# EAGLE schematic IGBS-Rocket-v2_rev1 (EAGLE 9.6.2)

## Sheet 1 of 11: MCU
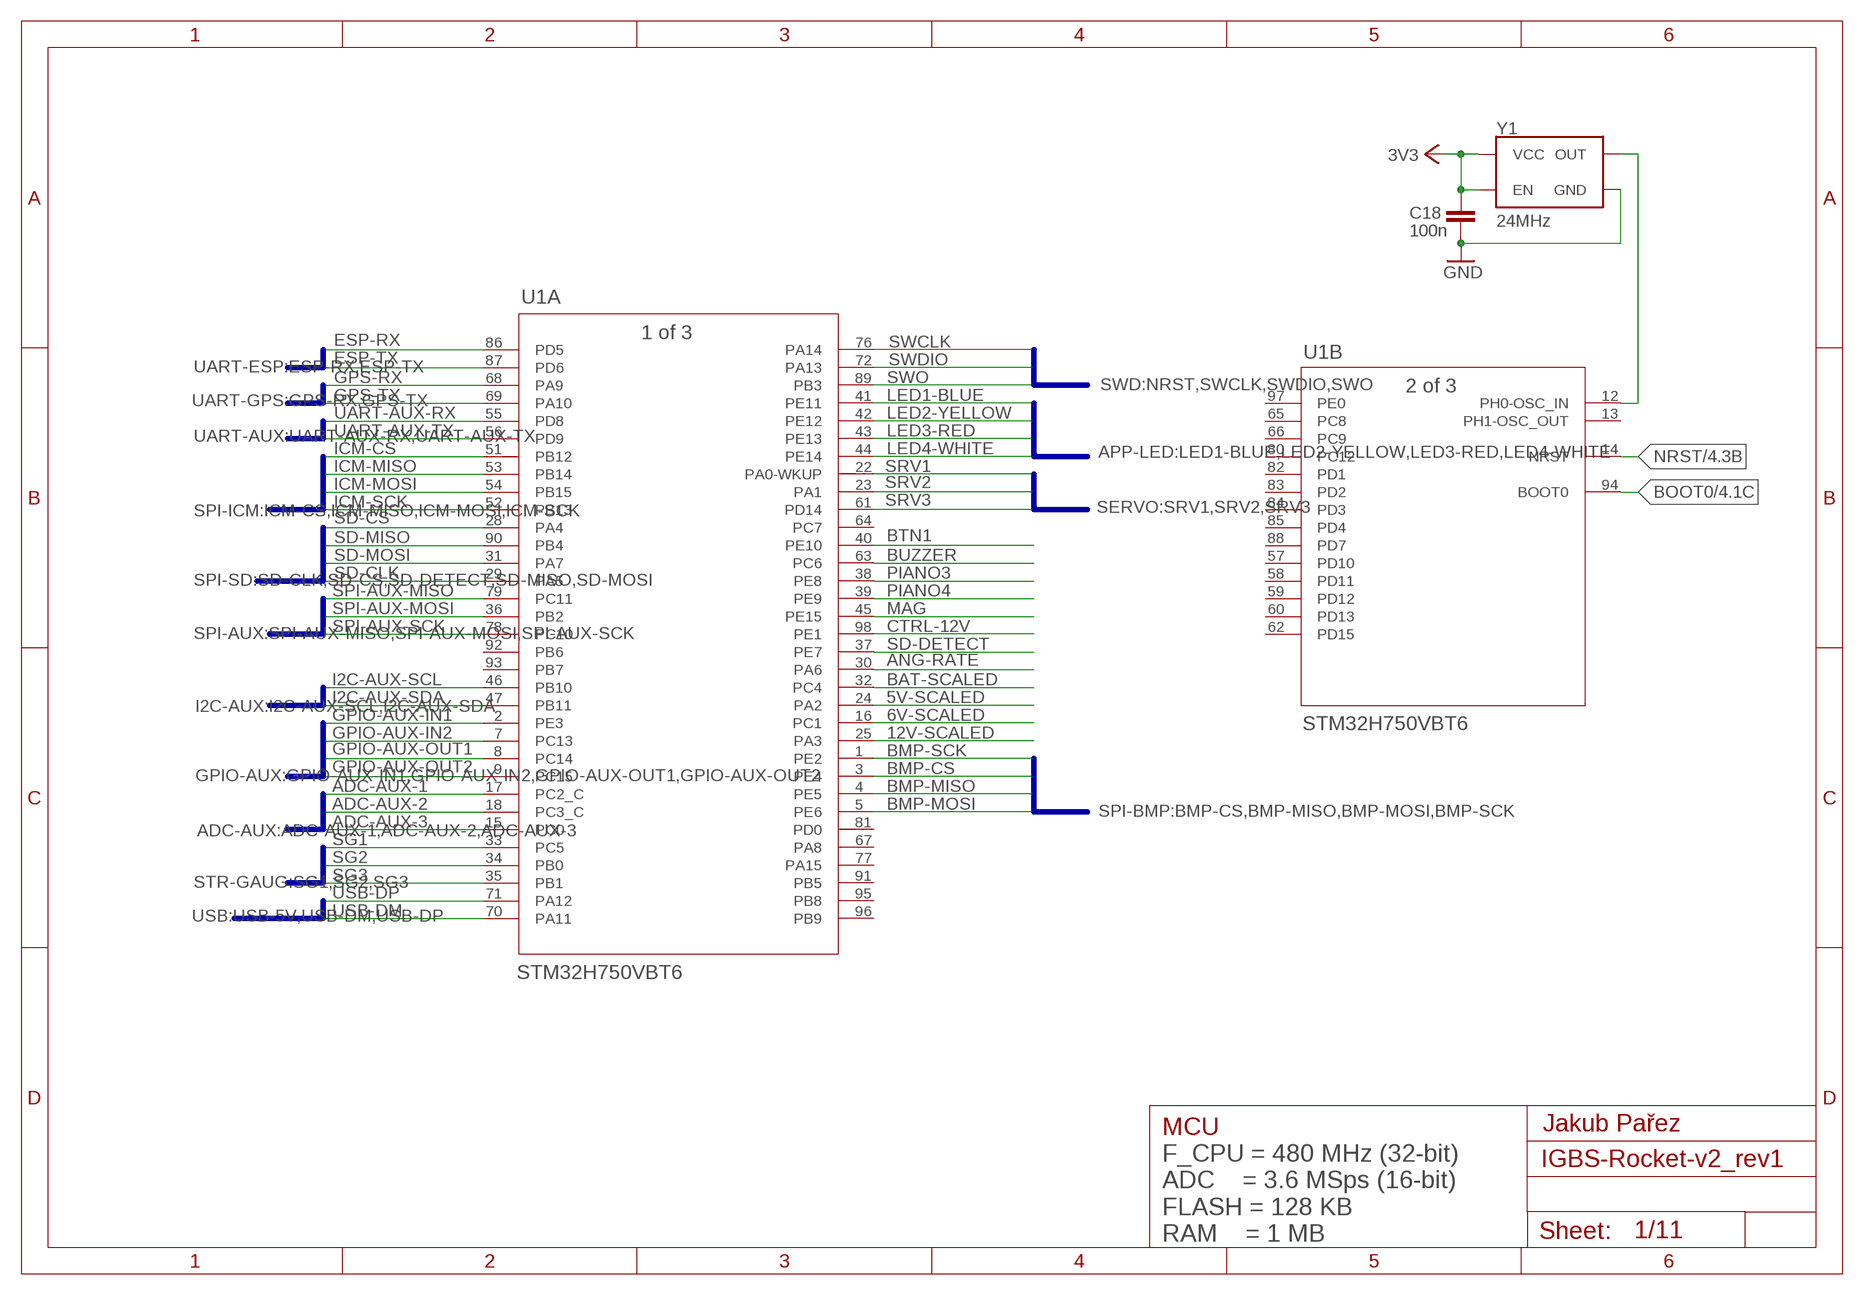
[diagram p0: schematic, sheet 1]

### Parts
C18  100n  C-EUC0603K  [C0603K]
U1  STM32H750VBT6  STM32H750VBT6LQFP100-14X14MM  [LQFP100-14X14MM]
Y1  24MHz  OSCILLATOR-16MHZSMD-7X5-4PAD  [OSCILLATOR-SMD-7X5-4PAD]

### Nets
3V3: C18.2 Y1.1(EN) Y1.4(VCC) ; also sheet 2,3,4,5,6,8,9,10
5V-SCALED: U1.24(A:PA2) ; also sheet 5
6V-SCALED: U1.16(A:PC1) ; also sheet 5
12V-SCALED: U1.25(A:PA3) ; also sheet 5
ADC-AUX-1: U1.17(A:PC2_C) ; also sheet 3
ADC-AUX-2: U1.18(A:PC3_C) ; also sheet 3
ADC-AUX-3: U1.15(A:PC0) ; also sheet 3
ANG-RATE: U1.30(A:PA6) ; also sheet 9
BAT-SCALED: U1.32(A:PC4) ; also sheet 5
BMP-CS: U1.3(A:PE4) ; also sheet 10
BMP-MISO: U1.4(A:PE5) ; also sheet 10
BMP-MOSI: U1.5(A:PE6) ; also sheet 10
BMP-SCK: U1.1(A:PE2) ; also sheet 10
BOOT0: U1.94(B:BOOT0) ; also sheet 4
BTN1: U1.40(A:PE10) ; also sheet 4
BUZZER: U1.63(A:PC6) ; also sheet 4
CTRL-12V: U1.98(A:PE1) ; also sheet 5
ESP-RX: U1.86(A:PD5) ; also sheet 8
ESP-TX: U1.87(A:PD6) ; also sheet 8
GND: C18.1 Y1.2(GND) ; also sheet 2,3,4,5,6,7,8,10
GPIO-AUX-IN1: U1.2(A:PE3) ; also sheet 3
GPIO-AUX-IN2: U1.7(A:PC13) ; also sheet 3
GPIO-AUX-OUT1: U1.8(A:PC14) ; also sheet 3
GPIO-AUX-OUT2: U1.9(A:PC15) ; also sheet 3
GPS-RX: U1.68(A:PA9) ; also sheet 10
GPS-TX: U1.69(A:PA10) ; also sheet 10
I2C-AUX-SCL: U1.46(A:PB10) ; also sheet 3
I2C-AUX-SDA: U1.47(A:PB11) ; also sheet 3
ICM-CS: U1.51(A:PB12) ; also sheet 10
ICM-MISO: U1.53(A:PB14) ; also sheet 10
ICM-MOSI: U1.54(A:PB15) ; also sheet 10
ICM-SCK: U1.52(A:PB13) ; also sheet 10
LED1-BLUE: U1.41(A:PE11) ; also sheet 4
LED2-YELLOW: U1.42(A:PE12) ; also sheet 4
LED3-RED: U1.43(A:PE13) ; also sheet 4
LED4-WHITE: U1.44(A:PE14) ; also sheet 4
MAG: U1.45(A:PE15) ; also sheet 10
N$7: U1.12(B:PH0-OSC_IN) Y1.3(OUT)
NRST: U1.14(B:NRST) ; also sheet 3,4
PIANO3: U1.38(A:PE8) ; also sheet 4
PIANO4: U1.39(A:PE9) ; also sheet 4
SD-CLK: U1.29(A:PA5) ; also sheet 7
SD-CS: U1.28(A:PA4) ; also sheet 7
SD-DETECT: U1.37(A:PE7) ; also sheet 7
SD-MISO: U1.90(A:PB4) ; also sheet 7
SD-MOSI: U1.31(A:PA7) ; also sheet 7
SG1: U1.33(A:PC5) ; also sheet 11
SG2: U1.34(A:PB0) ; also sheet 11
SG3: U1.35(A:PB1) ; also sheet 11
SPI-AUX-MISO: U1.79(A:PC11) ; also sheet 3
SPI-AUX-MOSI: U1.36(A:PB2) ; also sheet 3
SPI-AUX-SCK: U1.78(A:PC10) ; also sheet 3
SRV1: U1.22(A:PA0-WKUP) ; also sheet 5
SRV2: U1.23(A:PA1) ; also sheet 5
SRV3: U1.61(A:PD14) ; also sheet 5
SWCLK: U1.76(A:PA14) ; also sheet 3
SWDIO: U1.72(A:PA13) ; also sheet 3
SWO: U1.89(A:PB3) ; also sheet 3
UART-AUX-RX: U1.55(A:PD8) ; also sheet 3
UART-AUX-TX: U1.56(A:PD9) ; also sheet 3
USB-DM: U1.70(A:PA11) ; also sheet 3
USB-DP: U1.71(A:PA12) ; also sheet 3
Unconnected: U1.13(B:PH1-OSC_OUT) U1.57(B:PD10) U1.58(B:PD11) U1.59(B:PD12) U1.60(B:PD13) U1.62(B:PD15) U1.64(A:PC7) U1.65(B:PC8) U1.66(B:PC9) U1.67(A:PA8) U1.77(A:PA15) U1.80(B:PC12) U1.81(A:PD0) U1.82(B:PD1) U1.83(B:PD2) U1.84(B:PD3) U1.85(B:PD4) U1.88(B:PD7) U1.91(A:PB5) U1.92(A:PB6) U1.93(A:PB7) U1.95(A:PB8) U1.96(A:PB9) U1.97(B:PE0)

### Buses
UART-ESP:ESP-RX,ESP-TX
UART-GPS:GPS-RX,GPS-TX
UART-AUX:UART-AUX-RX,UART-AUX-TX
SPI-ICM:ICM-CS,ICM-MISO,ICM-MOSI,ICM-SCK
SPI-SD:SD-CLK,SD-CS,SD-DETECT,SD-MISO,SD-MOSI
SPI-AUX:SPI-AUX-MISO,SPI-AUX-MOSI,SPI-AUX-SCK
I2C-AUX:I2C-AUX-SCL,I2C-AUX-SDA
GPIO-AUX:GPIO-AUX-IN1,GPIO-AUX-IN2,GPIO-AUX-OUT1,GPIO-AUX-OUT2
ADC-AUX:ADC-AUX-1,ADC-AUX-2,ADC-AUX-3
STR-GAUG:SG1,SG2,SG3
USB:USB-5V,USB-DM,USB-DP
SWD:NRST,SWCLK,SWDIO,SWO
APP-LED:LED1-BLUE,LED2-YELLOW,LED3-RED,LED4-WHITE
SERVO:SRV1,SRV2,SRV3
SPI-BMP:BMP-CS,BMP-MISO,BMP-MOSI,BMP-SCK

### Notes on the sheet
- MCU | Jakub Pařez
- F_CPU = 480 MHz (32-bit)
  ADC    = 3.6 MSps (16-bit)
  FLASH = 128 KB
  RAM    = 1 MB

## Sheet 2 of 11: MCU PSU
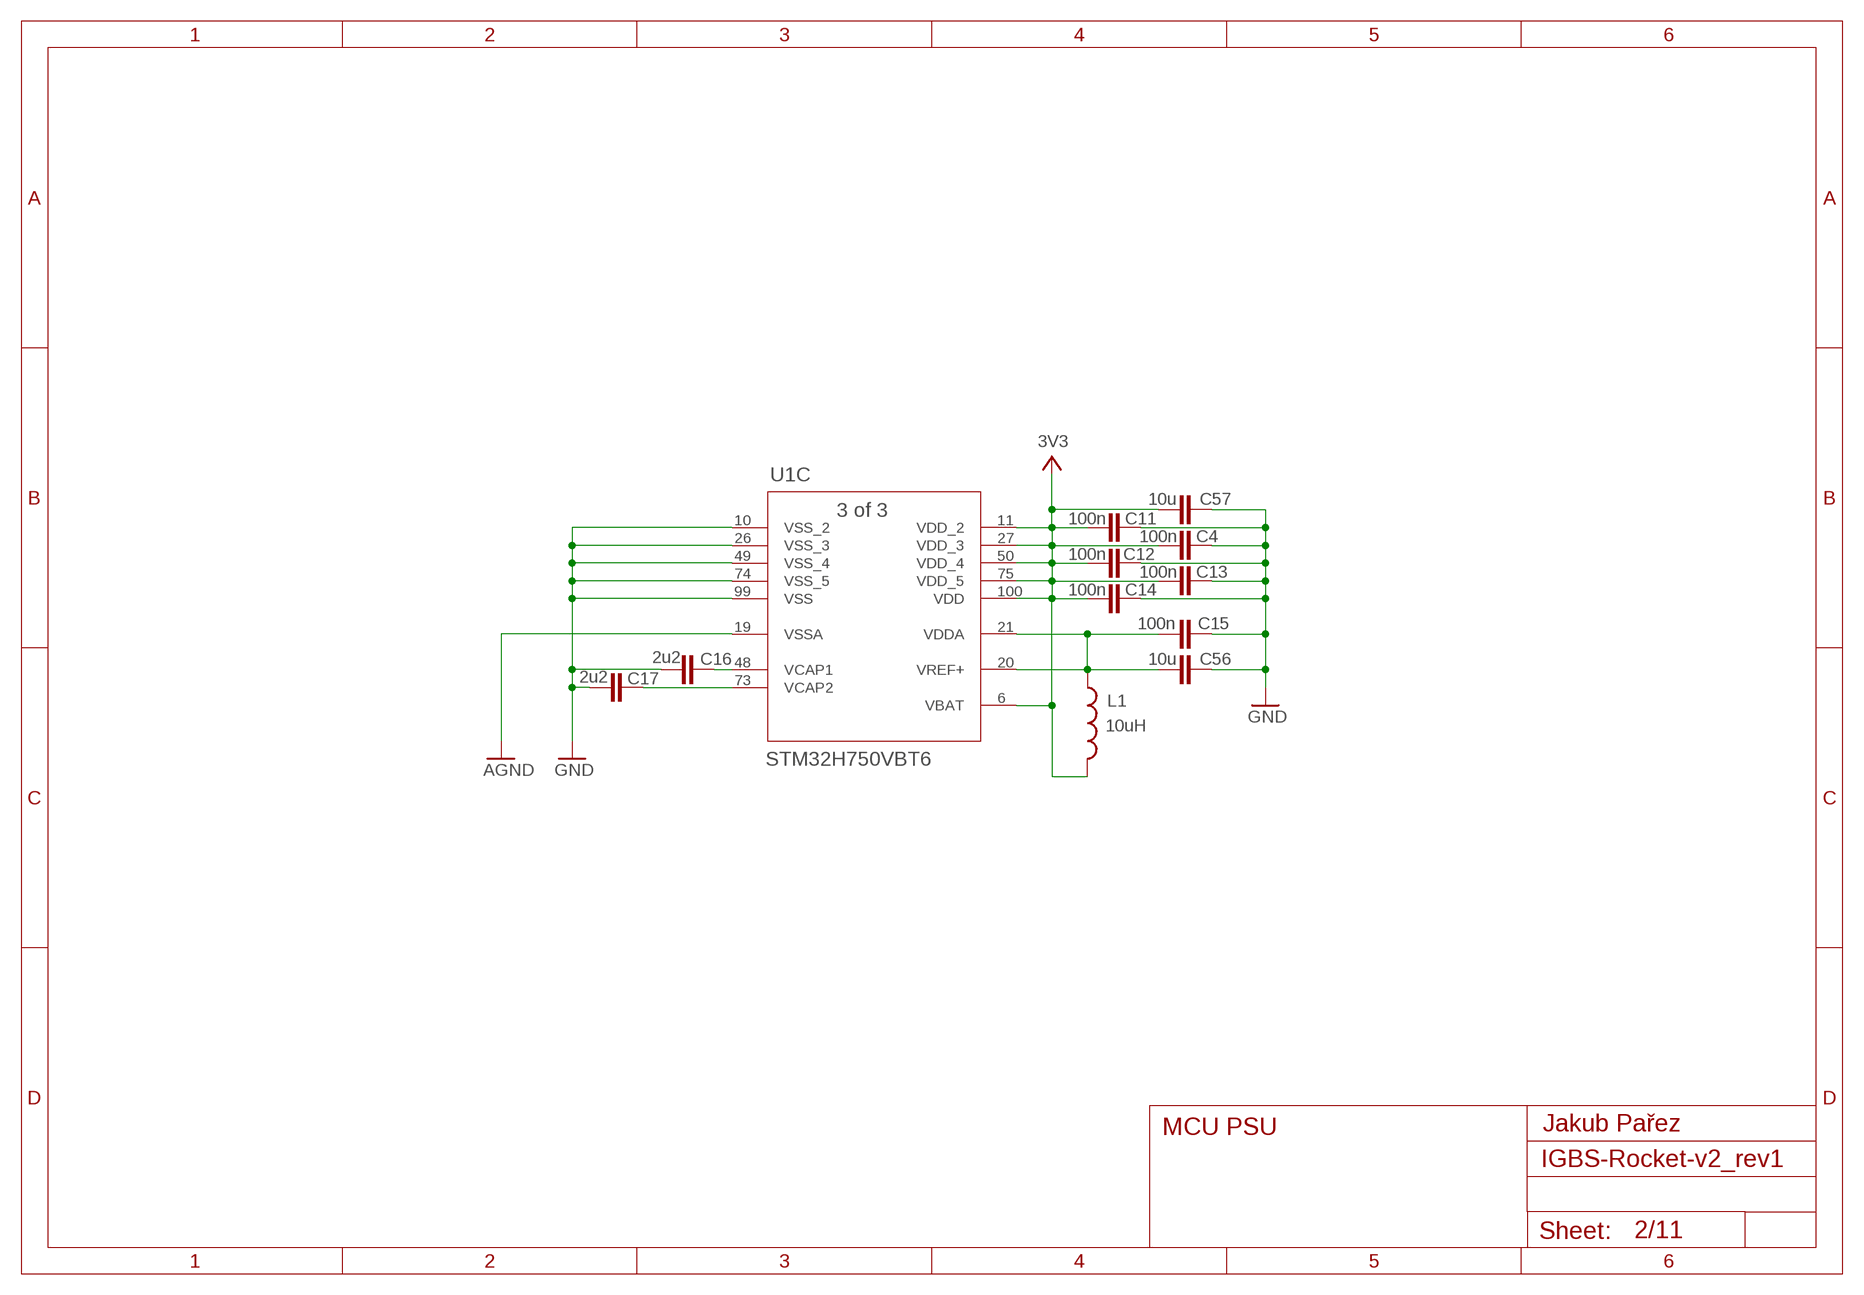
[diagram p1: schematic, sheet 2]

### Parts
C4  100n  C-EUC0603K  [C0603K]
C11  100n  C-EUC0603K  [C0603K]
C12  100n  C-EUC0603K  [C0603K]
C13  100n  C-EUC0603K  [C0603K]
C14  100n  C-EUC0603K  [C0603K]
C15  100n  C-EUC0603K  [C0603K]
C16  2u2  C-EUC0805K  [C0805K]
C17  2u2  C-EUC0805K  [C0805K]
C56  10u  10UF10V10%(0805)  [0805-CAP]
C57  10u  10UF10V10%(0805)  [0805-CAP]
L1  10uH  INDUCTOR0805  [0805]

### Nets
3V3: C4.2 C11.2 C12.2 C13.2 C14.2 C57.1 L1.2 U1.6(C:VBAT) U1.11(C:VDD_2) U1.27(C:VDD_3) U1.50(C:VDD_4) U1.75(C:VDD_5) U1.100(C:VDD) ; also sheet 1,3,4,5,6,8,9,10
AGND: U1.19(C:VSSA) ; also sheet 5,6,9,11
GND: C4.1 C11.1 C12.1 C13.1 C14.1 C15.1 C16.2 C17.1 C56.2 C57.2 U1.10(C:VSS_2) U1.26(C:VSS_3) U1.49(C:VSS_4) U1.74(C:VSS_5) U1.99(C:VSS) ; also sheet 1,3,4,5,6,7,8,10
N$4: C16.1 U1.48(C:VCAP1)
N$5: C17.2 U1.73(C:VCAP2)
VDDA: C15.2 C56.1 L1.1 U1.20(C:VREF+) U1.21(C:VDDA)

### Notes on the sheet
- MCU PSU | Jakub Pařez

## Sheet 3 of 11: Connectors
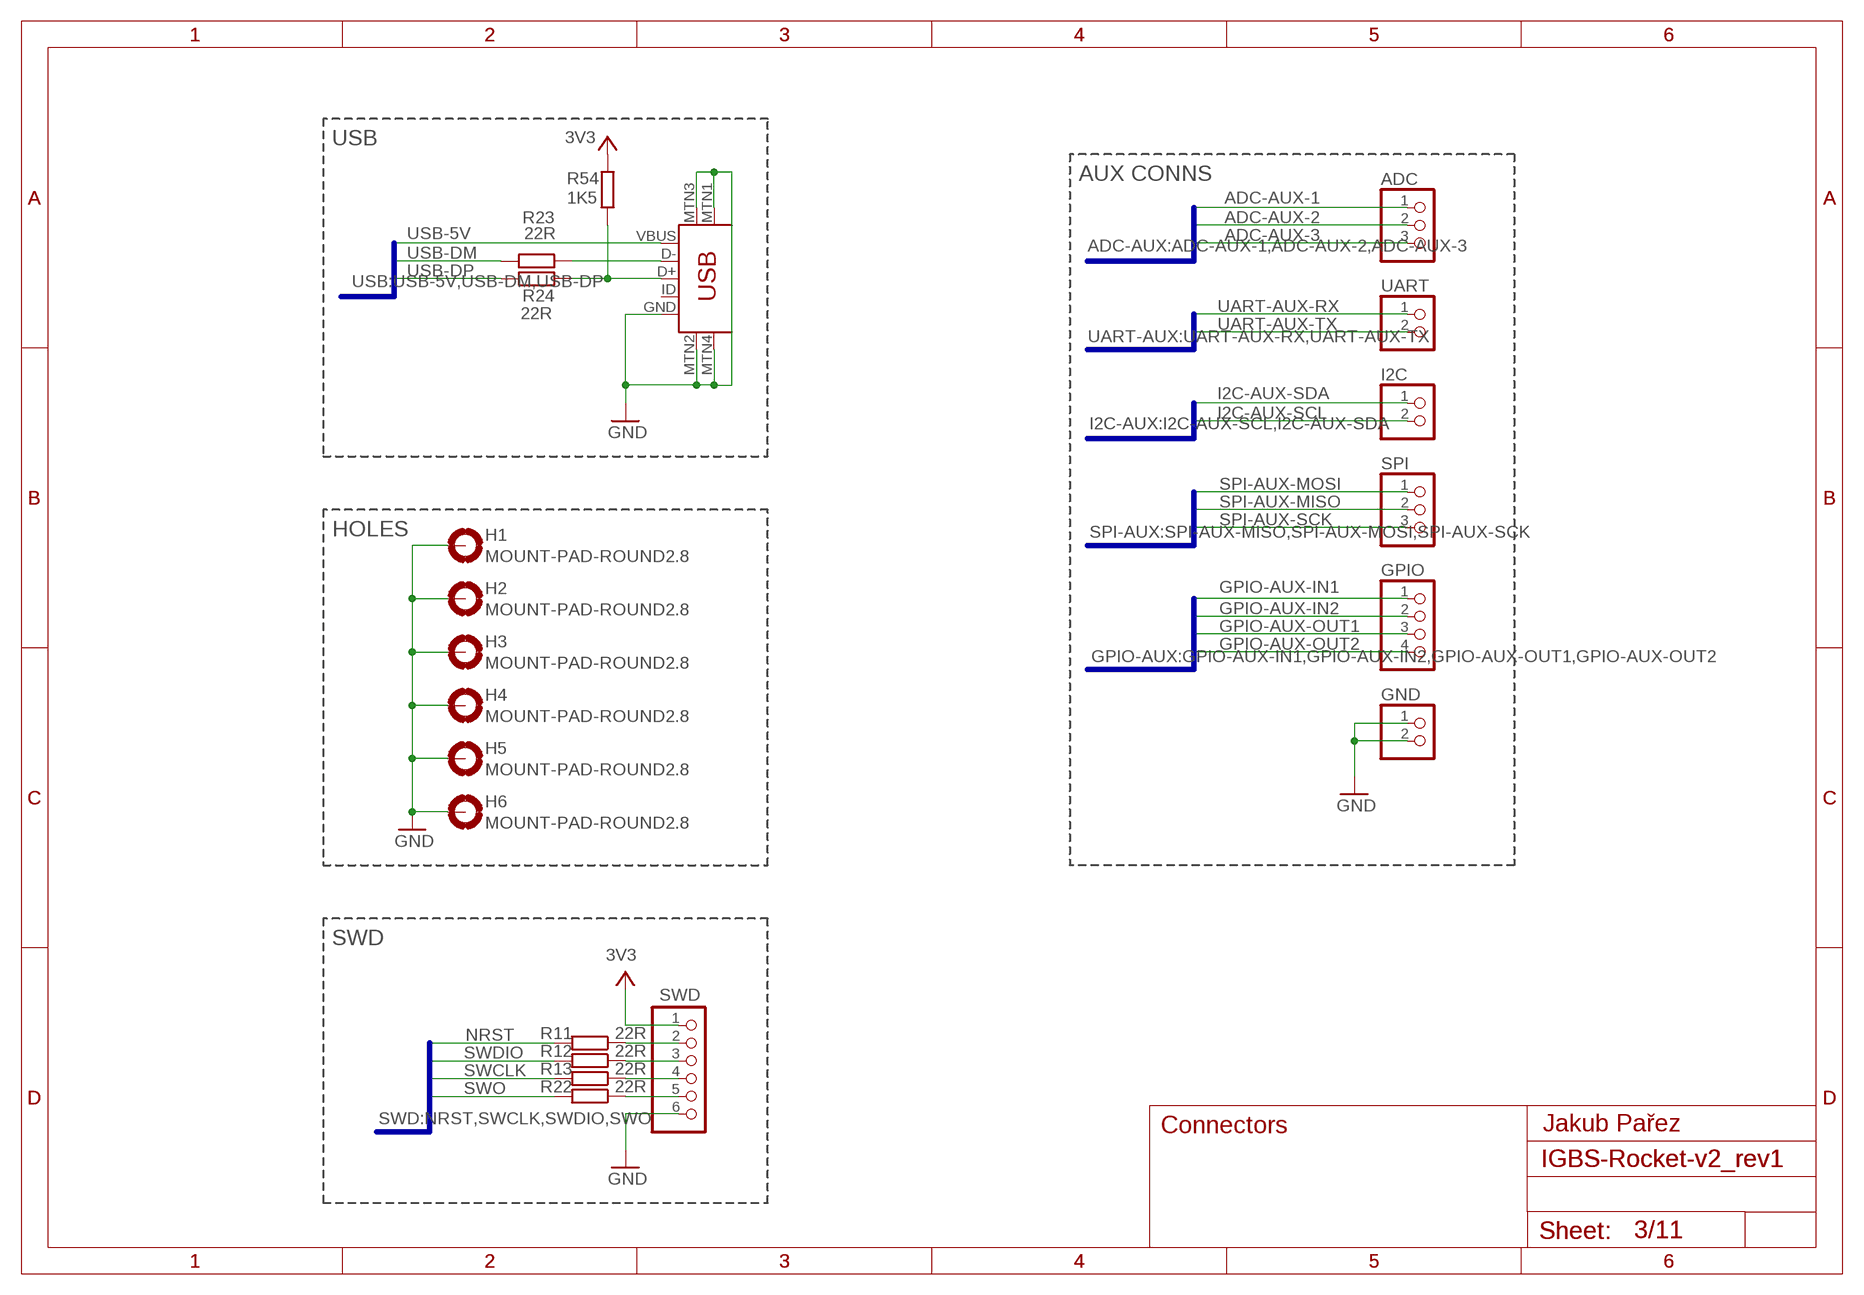
[diagram p2: schematic, sheet 3]

### Parts
ADC  PINHD-1X3  [1X03]
GND  PINHD-1X2  [1X02]
GPIO  PINHD-1X4  [1X04]
H1  MOUNT-PAD-ROUND2.8  [2,8-PAD]
H2  MOUNT-PAD-ROUND2.8  [2,8-PAD]
H3  MOUNT-PAD-ROUND2.8  [2,8-PAD]
H4  MOUNT-PAD-ROUND2.8  [2,8-PAD]
H5  MOUNT-PAD-ROUND2.8  [2,8-PAD]
H6  MOUNT-PAD-ROUND2.8  [2,8-PAD]
I2C  PINHD-1X2  [1X02]
R11  22R  R-EU_R0603  [R0603]
R12  22R  R-EU_R0603  [R0603]
R13  22R  R-EU_R0603  [R0603]
R22  22R  R-EU_R0603  [R0603]
R23  22R  R-EU_R0603  [R0603]
R24  22R  R-EU_R0603  [R0603]
R54  1K5  R-EU_R0603  [R0603]
SPI  PINHD-1X3  [1X03]
SWD  PINHD-1X6  [1X06]
UART  PINHD-1X2  [1X02]
USB  USB-MINIB-5PIN  [USB-MINIB]

### Nets
3V3: R54.2 SWD.1 ; also sheet 1,2,4,5,6,8,9,10
ADC-AUX-1: ADC.1 ; also sheet 1
ADC-AUX-2: ADC.2 ; also sheet 1
ADC-AUX-3: ADC.3 ; also sheet 1
GND: GND.1 GND.2 H1.B2,8(MOUNT) H2.B2,8(MOUNT) H3.B2,8(MOUNT) H4.B2,8(MOUNT) H5.B2,8(MOUNT) H6.B2,8(MOUNT) SWD.6 USB.GND USB.MTN1(MTN2) USB.MTN2(MTN3) USB.MTN3(MTN1) USB.MTN4 ; also sheet 1,2,4,5,6,7,8,10
GPIO-AUX-IN1: GPIO.1 ; also sheet 1
GPIO-AUX-IN2: GPIO.2 ; also sheet 1
GPIO-AUX-OUT1: GPIO.3 ; also sheet 1
GPIO-AUX-OUT2: GPIO.4 ; also sheet 1
I2C-AUX-SCL: I2C.2 ; also sheet 1
I2C-AUX-SDA: I2C.1 ; also sheet 1
N$6: R11.1 SWD.2
N$8: R12.1 SWD.3
N$14: R13.1 SWD.4
N$17: R22.1 SWD.5
N$19: R23.1 USB.D-
N$52: R24.1 R54.1 USB.D+
NRST: R11.2 ; also sheet 1,4
SPI-AUX-MISO: SPI.2 ; also sheet 1
SPI-AUX-MOSI: SPI.1 ; also sheet 1
SPI-AUX-SCK: SPI.3 ; also sheet 1
SWCLK: R13.2 ; also sheet 1
SWDIO: R12.2 ; also sheet 1
SWO: R22.2 ; also sheet 1
UART-AUX-RX: UART.1 ; also sheet 1
UART-AUX-TX: UART.2 ; also sheet 1
USB-5V: USB.VBUS
USB-DM: R23.2 ; also sheet 1
USB-DP: R24.2 ; also sheet 1
Unconnected: USB.ID

### Buses
SWD:NRST,SWCLK,SWDIO,SWO
USB:USB-5V,USB-DM,USB-DP
ADC-AUX:ADC-AUX-1,ADC-AUX-2,ADC-AUX-3
UART-AUX:UART-AUX-RX,UART-AUX-TX
I2C-AUX:I2C-AUX-SCL,I2C-AUX-SDA
SPI-AUX:SPI-AUX-MISO,SPI-AUX-MOSI,SPI-AUX-SCK
GPIO-AUX:GPIO-AUX-IN1,GPIO-AUX-IN2,GPIO-AUX-OUT1,GPIO-AUX-OUT2

### Notes on the sheet
- USB
- AUX CONNS
- HOLES
- SWD
- Connectors | Jakub Pařez

## Sheet 4 of 11: User Interaction
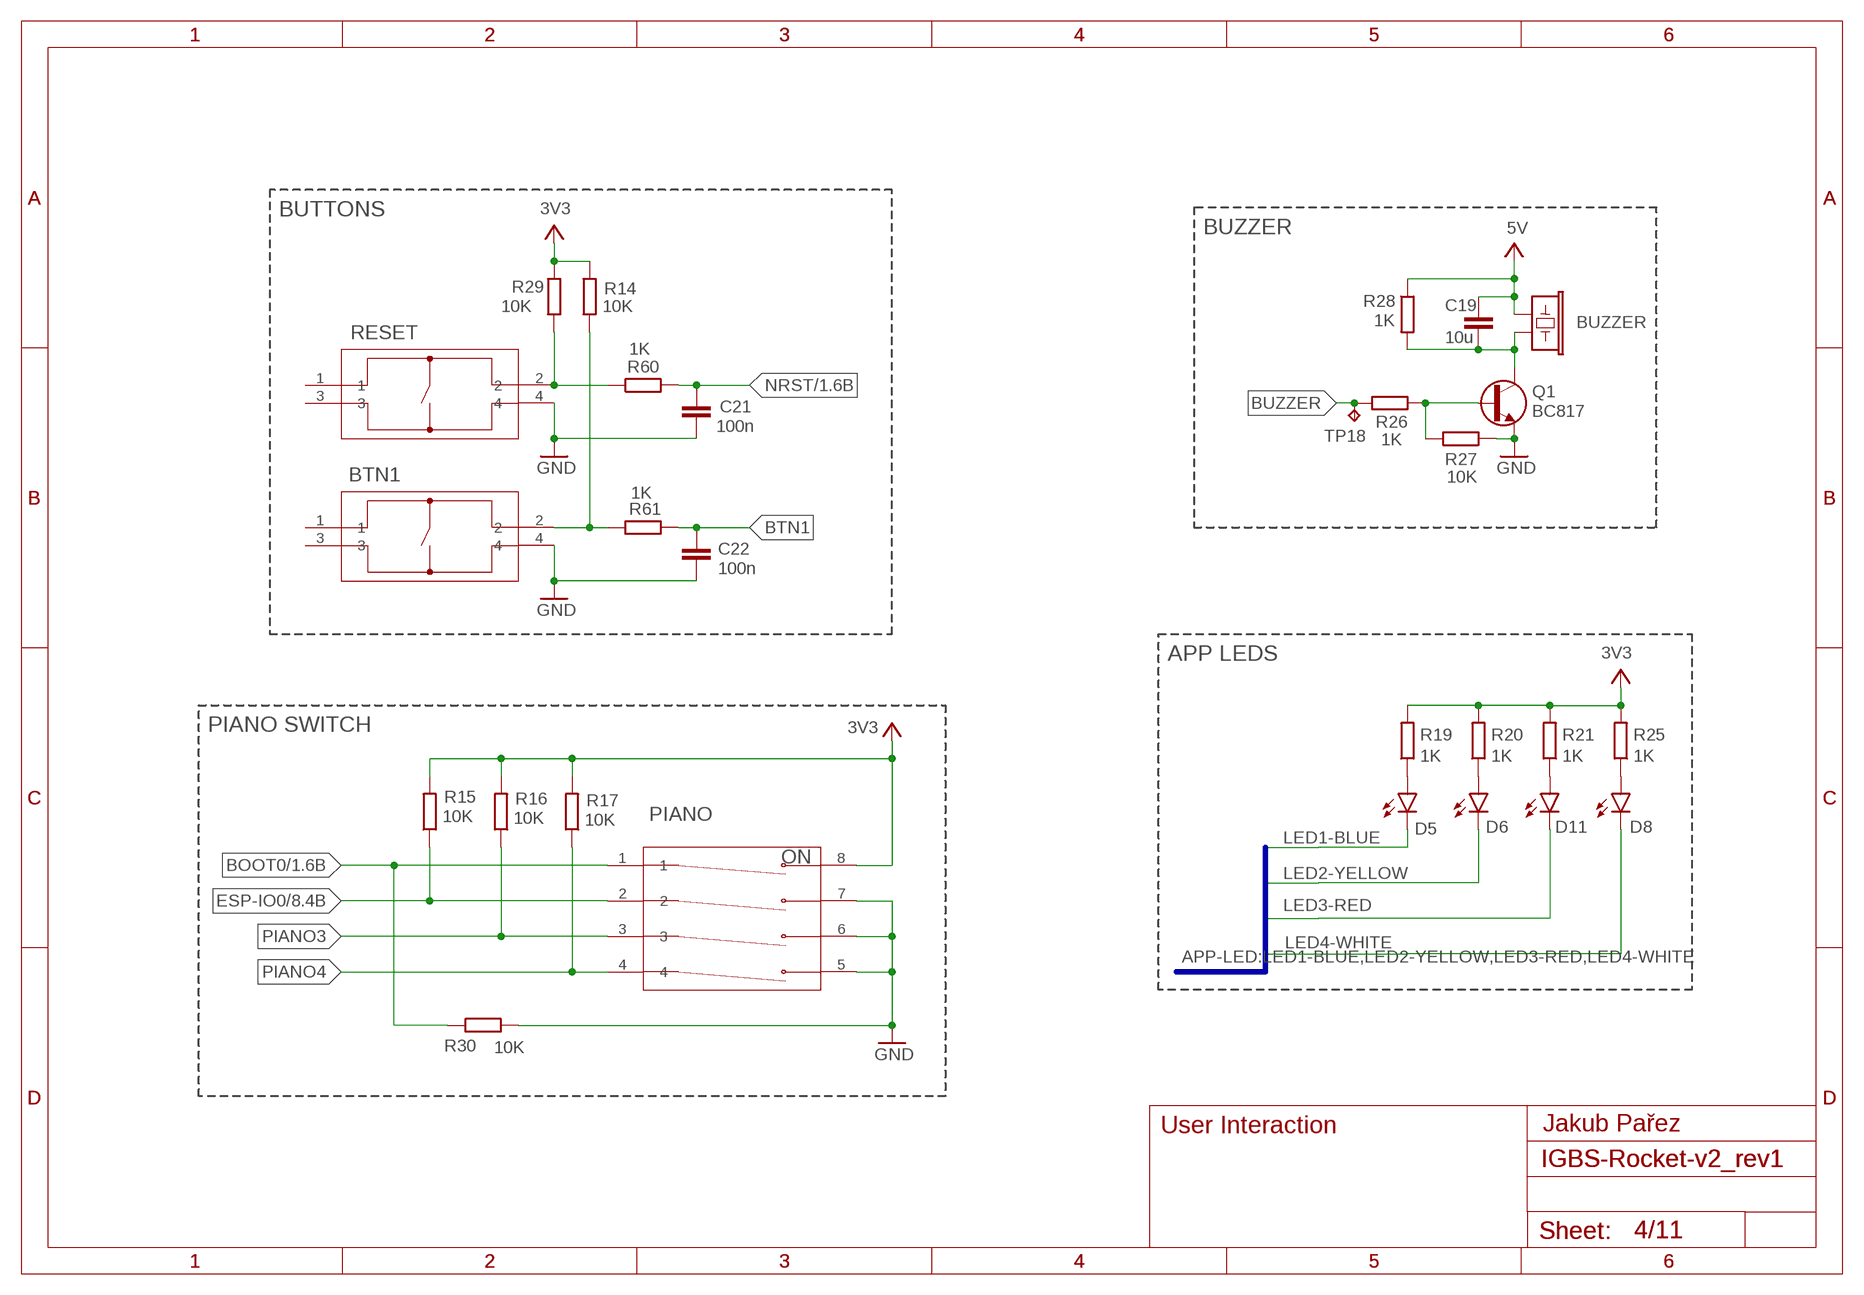
[diagram p3: schematic, sheet 4]

### Parts
BTN1  B3FS-1000SW_B3FS-1000_OMR  [SW_B3FS-1000_OMR]
BUZZER  BUZZERPTH  [BUZZER-12MM]
C19  10u  10UF10V10%(0805)  [0805-CAP]
C21  100n  C-EUC0603K  [C0603K]
C22  100n  C-EUC0603K  [C0603K]
D5  GREEN  LED-GREEN1206  [LED-1206]
D6  GREEN  LED-GREEN1206  [LED-1206]
D8  GREEN  LED-GREEN1206  [LED-1206]
D11  GREEN  LED-GREEN1206  [LED-1206]
PIANO  A6FR-4101SW_A6FR-4101_OMR  [SW_A6FR-4101_OMR]
Q1  BC817  BC817-16LT1SMD  [SOT23-BEC]
R14  10K  R-EU_R0603  [R0603]
R15  10K  R-EU_R0603  [R0603]
R16  10K  R-EU_R0603  [R0603]
R17  10K  R-EU_R0603  [R0603]
R19  1K  R-EU_R0603  [R0603]
R20  1K  R-EU_R0603  [R0603]
R21  1K  R-EU_R0603  [R0603]
R25  1K  R-EU_R0603  [R0603]
R26  1K  R-EU_R0603  [R0603]
R27  10K  R-EU_R0603  [R0603]
R28  1K  R-EU_R0603  [R0603]
R29  10K  R-EU_R0603  [R0603]
R30  10K  R-EU_R0603  [R0603]
R60  1K  R-EU_R0603  [R0603]
R61  1K  R-EU_R0603  [R0603]
RESET  B3FS-1000SW_B3FS-1000_OMR  [SW_B3FS-1000_OMR]
TP18  TPB1,27  [B1,27]

### Nets
3V3: PIANO.8 R14.1 R15.2 R16.2 R17.2 R19.2 R20.2 R21.2 R25.2 R29.1 ; also sheet 1,2,3,5,6,8,9,10
5V: BUZZER.+ C19.1 R28.1 ; also sheet 5,6,9,10,11
5V-BUZZER: BUZZER.- C19.2 Q1.C R28.2
BOOT0: PIANO.1 R30.1 ; also sheet 1
BTN1: C22.1 R61.2 ; also sheet 1
BTN12: BTN1.2 R14.2 R61.1
BUZZER: R26.2 TP18.TP ; also sheet 1
ESP-IO0: PIANO.2 R15.1 ; also sheet 8
GND: BTN1.4 C21.2 C22.2 PIANO.5 PIANO.6 PIANO.7 Q1.E R27.1 R30.2 RESET.4 ; also sheet 1,2,3,5,6,7,8,10
LED1-BLUE: D5.C ; also sheet 1
LED2-YELLOW: D6.C ; also sheet 1
LED3-RED: D11.C ; also sheet 1
LED4-WHITE: D8.C ; also sheet 1
N$1: D8.A R25.1
N$21: D5.A R19.1
N$22: D6.A R20.1
N$23: D11.A R21.1
N$28: Q1.B R26.1 R27.2
NRST: C21.1 R60.2 ; also sheet 1,3
NRST2: R29.2 R60.1 RESET.2
PIANO3: PIANO.3 R16.1 ; also sheet 1
PIANO4: PIANO.4 R17.1 ; also sheet 1
Unconnected: BTN1.1 BTN1.3 RESET.1 RESET.3

### Buses
APP-LED:LED1-BLUE,LED2-YELLOW,LED3-RED,LED4-WHITE

### Notes on the sheet
- BUTTONS
- BUZZER
- APP LEDS
- PIANO SWITCH
- User Interaction | Jakub Pařez

## Sheet 5 of 11: PSU
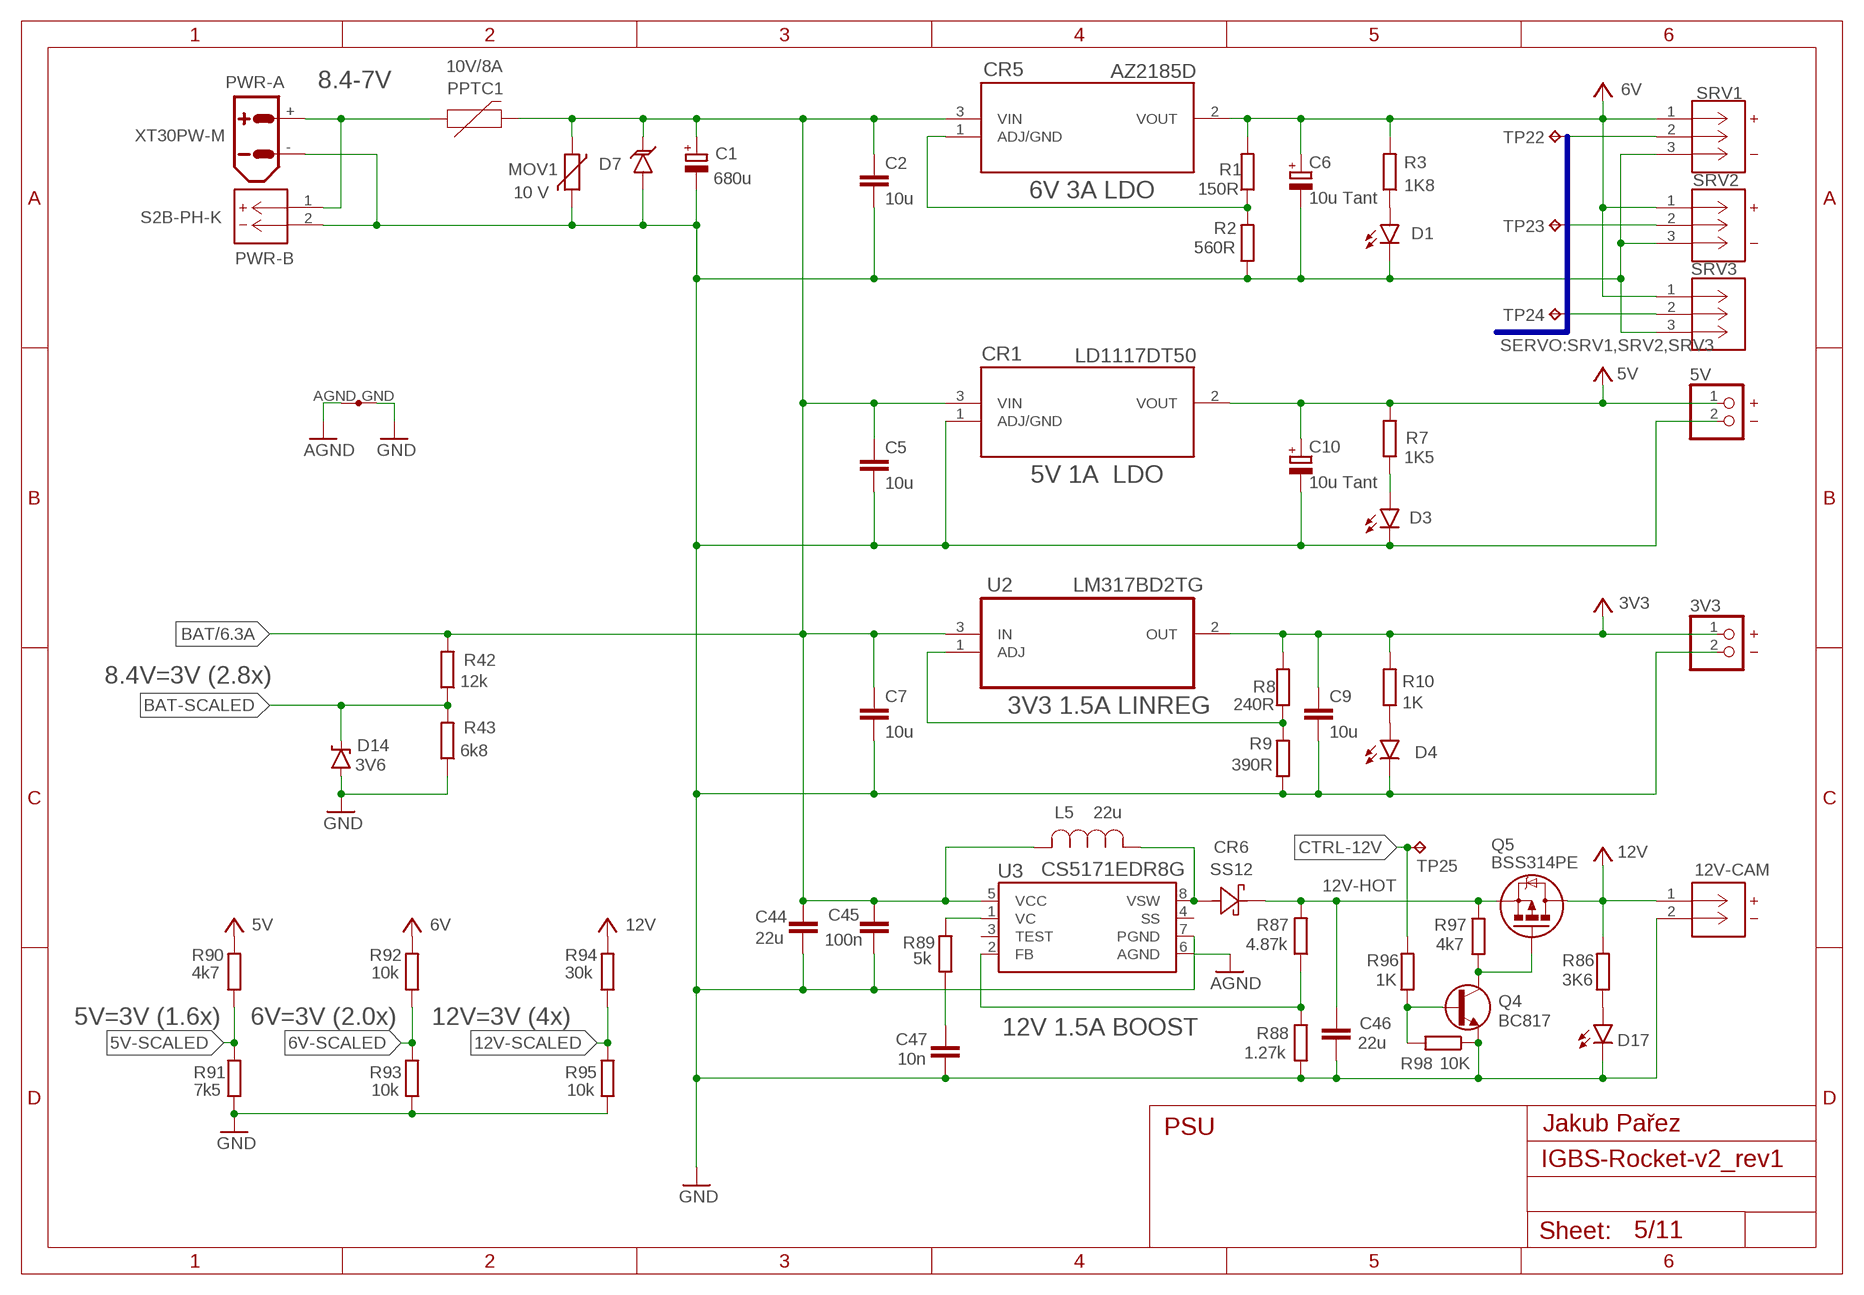
[diagram p4: schematic, sheet 5]

### Parts
3V3  PINHD-1X2  [1X02]
5V  PINHD-1X2  [1X02]
12V-CAM  S2B-XH-A(LF)(SN)CONN_S2B-XH-A_JST  [CONN_S2B-XH-A_JST]
C1  680u  CPOL-EUTT2D7L  [TT2D7L]
C2  10u  10UF10V10%(0805)  [0805-CAP]
C5  10u  10UF10V10%(0805)  [0805-CAP]
C6  10u Tant  CPOL-EUCT3216  [CT3216]
C7  10u  10UF10V10%(0805)  [0805-CAP]
C9  10u  10UF10V10%(0805)  [0805-CAP]
C10  10u Tant  CPOL-EUCT3216  [CT3216]
C44  22u  10UF10V10%(0805)  [0805-CAP]
C45  100n  C-EUC0805K  [C0805K]
C46  22u  10UF10V10%(0805)  [0805-CAP]
C47  10n  C-EUC0805K  [C0805K]
CR1  LD1117DT50  LD1117DT50TR  [DPAK229P990X239-3N]
CR5  AZ2185D  [DPAK229P990X239-3N]
CR6  SS12  SS12-E3/5ATDIODE_DO214AC  [DIODE_DO214AC]
D1  GREEN  LED-GREEN1206  [LED-1206]
D3  GREEN  LED-GREEN1206  [LED-1206]
D4  GREEN  LED-GREEN1206  [LED-1206]
D7  TVSSMA  [SMA-DIODE]
D14  3V6  DIODE-ZENER16V  [SOD-123]
D17  GREEN  LED-GREEN1206  [LED-1206]
L5  22u  744373240047IND_74437_WRE  [IND_74437_WRE]
MOV1  10 V  VARISTORCN0805  [CT/CN0805]
PPTC1  10V/8A  PPTC_6V2A  [1210]
PWR-A  XT30PW-M  [XT30PW-M]
PWR-B  S2B-PH-K-S  S2B-PH-K-S(LF)(SN)CONN_S2B-PH-K-S_JST  [CONN_S2B-PH-K-S_JST]
Q4  BC817  BC817-16LT1SMD  [SOT23-BEC]
Q5  BSS314PE  MOSFET-PCHANNEL  [SOT23-3]
R1  150R  R-EU_R0603  [R0603]
R2  560R  R-EU_R0603  [R0603]
R3  1K8  R-EU_R0603  [R0603]
R7  1K5  R-EU_R0603  [R0603]
R8  240R  R-EU_R0603  [R0603]
R9  390R  R-EU_R0603  [R0603]
R10  1K  R-EU_R0603  [R0603]
R42  12k  R-EU_R0603  [R0603]
R43  6k8  R-EU_R0603  [R0603]
R86  3K6  R-EU_R0603  [R0603]
R87  4.87k  R-EU_R0603  [R0603]
R88  1.27k  R-EU_R0603  [R0603]
R89  5k  R-EU_R0603  [R0603]
R90  4k7  R-EU_R0603  [R0603]
R91  7k5  R-EU_R0603  [R0603]
R92  10k  R-EU_R0603  [R0603]
R93  10k  R-EU_R0603  [R0603]
R94  30k  R-EU_R0603  [R0603]
R95  10k  R-EU_R0603  [R0603]
R96  1K  R-EU_R0603  [R0603]
R97  4k7  R-EU_R0603  [R0603]
R98  10K  R-EU_R0603  [R0603]
SRV1  S3B-XH-A  S3B-XH-A(LF)(SN)CONN_S3B-XH-A(LF)(SN)_JST  [CONN_S3B-XH-A(LF)(SN)_JST]
SRV2  S3B-XH-A(LF)(SN)CONN_S3B-XH-A(LF)(SN)_JST  [CONN_S3B-XH-A(LF)(SN)_JST]
SRV3  S3B-XH-A(LF)(SN)CONN_S3B-XH-A(LF)(SN)_JST  [CONN_S3B-XH-A(LF)(SN)_JST]
TP22  TPB1,27  [B1,27]
TP23  TPB1,27  [B1,27]
TP24  TPB1,27  [B1,27]
TP25  TPB1,27  [B1,27]
U2  LM317BD2TG  [TO263]
U3  CS5171EDR8G  CS5171EDR8GSOIC8_ONS  [SOIC8_ONS]
U$1  SHORT  [SHORT]

### Nets
3V3: 3V3.1 C9.1 R8.2 R10.2 U2.2(OUT) ; also sheet 1,2,3,4,6,8,9,10
5V: 5V.1 C10.+ CR1.2(VOUT) R7.2 R90.2 ; also sheet 4,6,9,10,11
5V-SCALED: R90.1 R91.2 ; also sheet 1
6V: C6.+ CR5.2(VOUT) R1.2 R3.2 R92.2 SRV1.1 SRV2.1 SRV3.1
6V-SCALED: R92.1 R93.2 ; also sheet 1
12V: 12V-CAM.1 Q5.3(D) R86.2 R94.2
12V-FB: CR6.2 L5.1 U3.8(VSW)
12V-HOT: C46.1 CR6.1 Q5.2(S) R87.2 R97.1
12V-SCALED: R94.1 R95.2 ; also sheet 1
AGND: U3.6(AGND) U$1.AGND ; also sheet 2,6,9,11
BAT: C1.+ C2.1 C5.1 C7.1 C44.1 C45.2 CR1.3(VIN) CR5.3(VIN) D7.C L5.2 MOV1.1 PPTC1.2 R42.2 U2.3(IN) U3.5(VCC) ; also sheet 6
BAT2: PPTC1.1 PWR-A.+ PWR-B.1
BAT-SCALED: D14.C R42.1 R43.2 ; also sheet 1
CTRL-12V: R96.2 TP25.TP ; also sheet 1
GND: 3V3.2 5V.2 12V-CAM.2 C1.- C2.2 C5.2 C6.- C7.2 C9.2 C10.- C44.2 C45.1 C46.2 C47.1 CR1.1(ADJ/GND) D1.C D3.C D4.C D7.A D14.A D17.C MOV1.2 PWR-A.- PWR-B.2 Q4.E R2.1 R9.1 R43.1 R88.1 R91.1 R93.1 R95.1 R98.1 SRV1.3 SRV2.3 SRV3.3 U3.7(PGND) U$1.GND ; also sheet 1,2,3,4,6,7,8,10
N$9: CR5.1(ADJ/GND) R1.1 R2.2
N$10: D1.A R3.1
N$13: D3.A R7.1
N$15: R8.1 R9.2 U2.1(ADJ)
N$16: D4.A R10.1
N$18: R87.1 R88.2 U3.2(FB)
N$59: D17.A R86.1
N$67: Q4.B R96.1 R98.2
N$70: C47.2 R89.1
N$71: R89.2 U3.1(VC)
N$72: Q4.C Q5.1(G) R97.2
SRV1: SRV1.2 TP22.TP ; also sheet 1
SRV2: SRV2.2 TP23.TP ; also sheet 1
SRV3: SRV3.2 TP24.TP ; also sheet 1
Unconnected: U3.3(TEST) U3.4(SS)

### Buses
SERVO:SRV1,SRV2,SRV3

### Notes on the sheet
- 8.4-7V
- 6V 3A LDO
- S2B-PH-K
- 5V 1A  LDO
- 8.4V=3V (2.8x)
- 3V3 1.5A LINREG
- 5V=3V (1.6x) | 6V=3V (2.0x) | 12V=3V (4x)
- 12V 1.5A BOOST
- PSU | Jakub Pařez

## Sheet 6 of 11: Voltage Meter
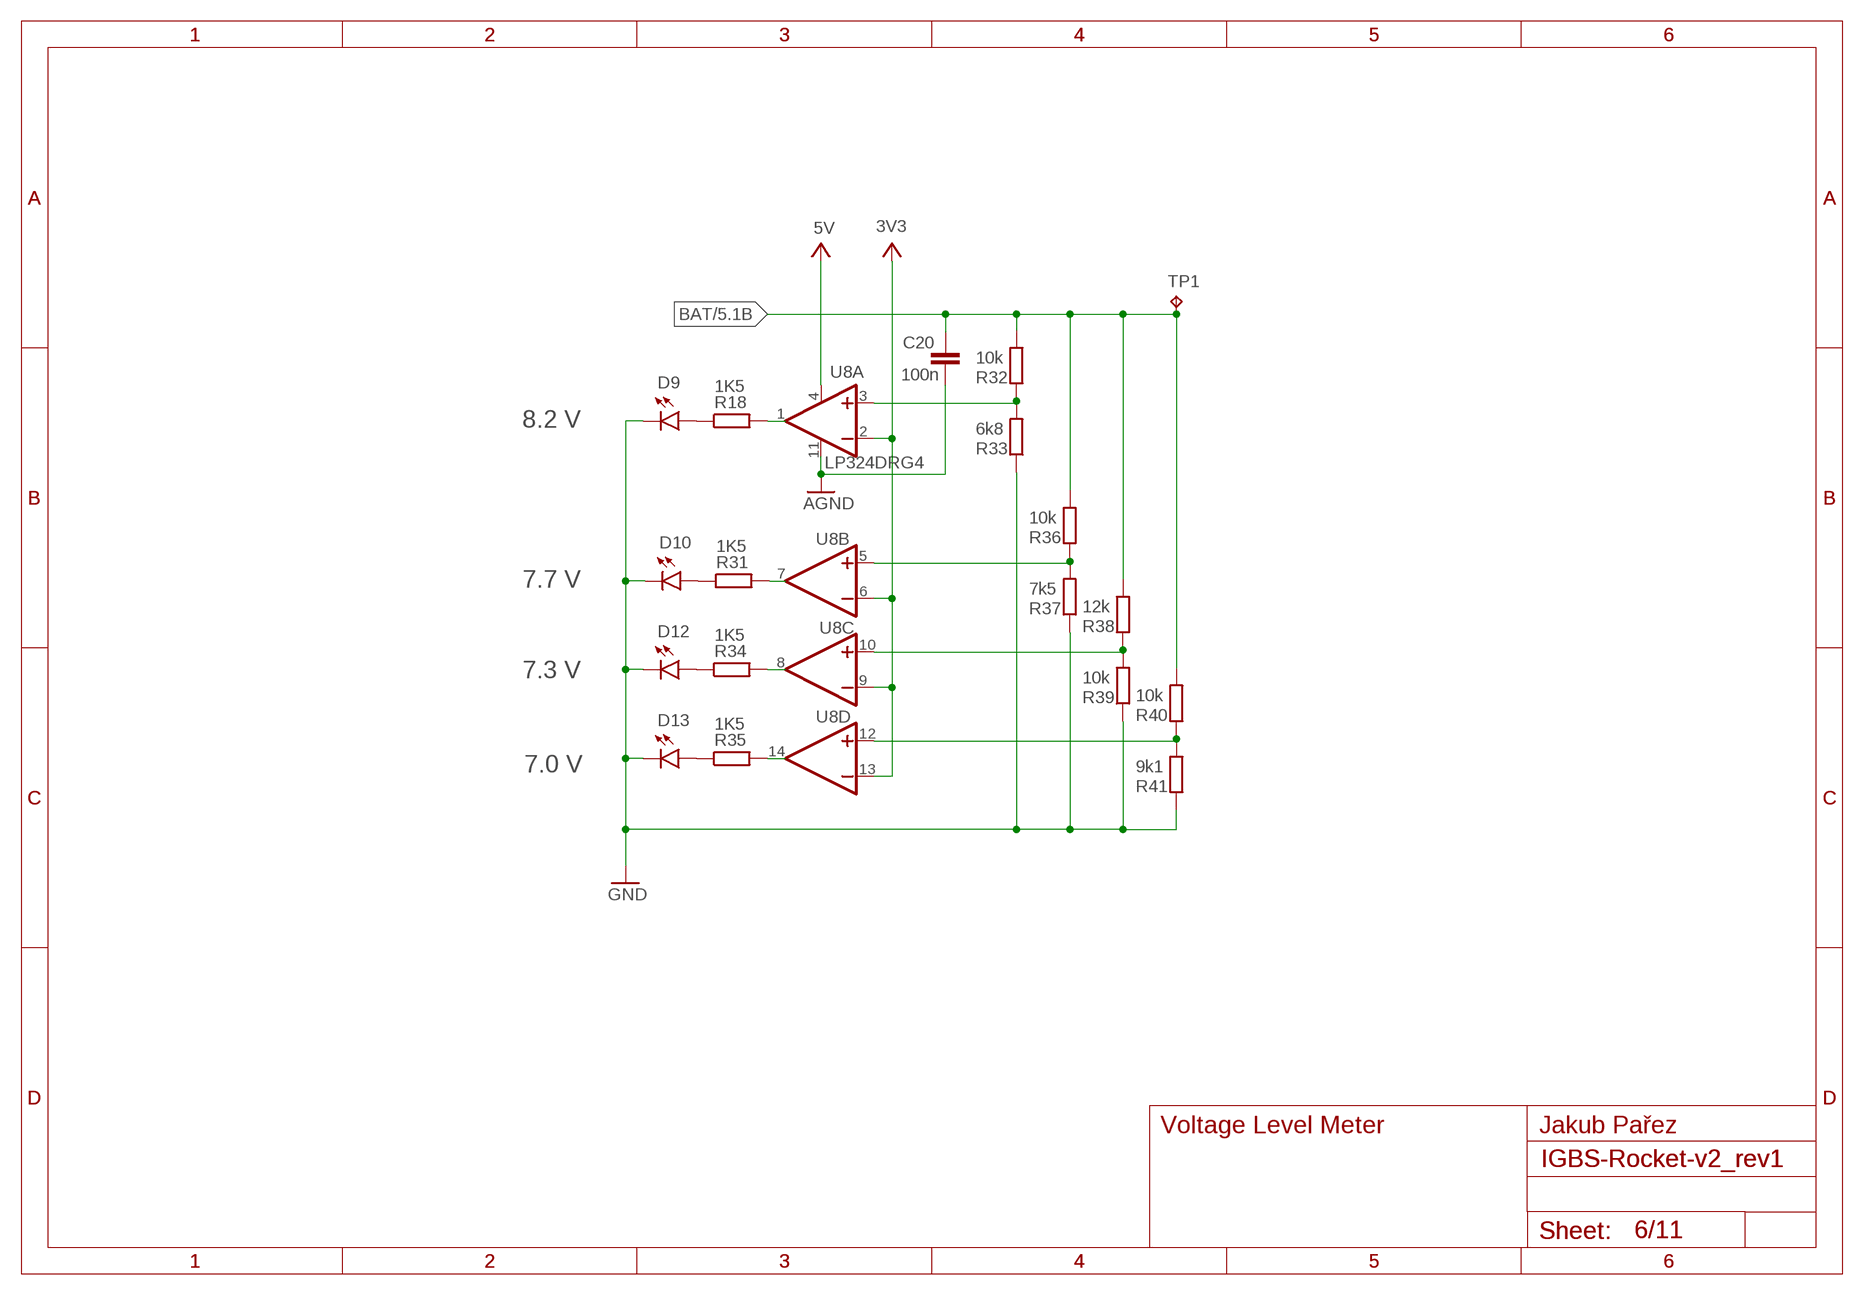
[diagram p5: schematic, sheet 6]

### Parts
C20  100n  C-EUC0603K  [C0603K]
D9  GREEN  LED-GREEN1206  [LED-1206]
D10  GREEN  LED-GREEN1206  [LED-1206]
D12  GREEN  LED-GREEN1206  [LED-1206]
D13  GREEN  LED-GREEN1206  [LED-1206]
R18  1K5  R-EU_R0603  [R0603]
R31  1K5  R-EU_R0603  [R0603]
R32  10k  R-EU_R0603  [R0603]
R33  6k8  R-EU_R0603  [R0603]
R34  1K5  R-EU_R0603  [R0603]
R35  1K5  R-EU_R0603  [R0603]
R36  10k  R-EU_R0603  [R0603]
R37  7k5  R-EU_R0603  [R0603]
R38  12k  R-EU_R0603  [R0603]
R39  10k  R-EU_R0603  [R0603]
R40  10k  R-EU_R0603  [R0603]
R41  9k1  R-EU_R0603  [R0603]
TP1  TPB2,54  [B2,54]
U8  LP324DRG4  LP324DRG4D14  [D14]

### Nets
3V3: U8.2(A:-) U8.6(B:-) U8.9(C:-) U8.13(D:-) ; also sheet 1,2,3,4,5,8,9,10
5V: U8.4(P:VCC) ; also sheet 4,5,9,10,11
AGND: C20.1 U8.11(P:GND) ; also sheet 2,5,9,11
BAT: C20.2 R32.2 R36.2 R38.2 R40.2 TP1.TP ; also sheet 5
GND: D9.C D10.C D12.C D13.C R33.1 R37.1 R39.1 R41.1 ; also sheet 1,2,3,4,5,7,8,10
N$30: D9.A R18.1
N$31: D10.A R31.1
N$32: D12.A R34.1
N$33: D13.A R35.1
N$34: R35.2 U8.14(D:OUT)
N$35: R34.2 U8.8(C:OUT)
N$36: R31.2 U8.7(B:OUT)
N$37: R18.2 U8.1(A:OUT)
N$38: R32.1 R33.2 U8.3(A:+)
N$40: R36.1 R37.2 U8.5(B:+)
N$41: R38.1 R39.2 U8.10(C:+)
N$42: R40.1 R41.2 U8.12(D:+)

### Notes on the sheet
- 8.2 V
- 7.7 V
- 7.3 V
- 7.0 V
- Voltage Level Meter | Jakub Pařez

## Sheet 7 of 11: SD Card
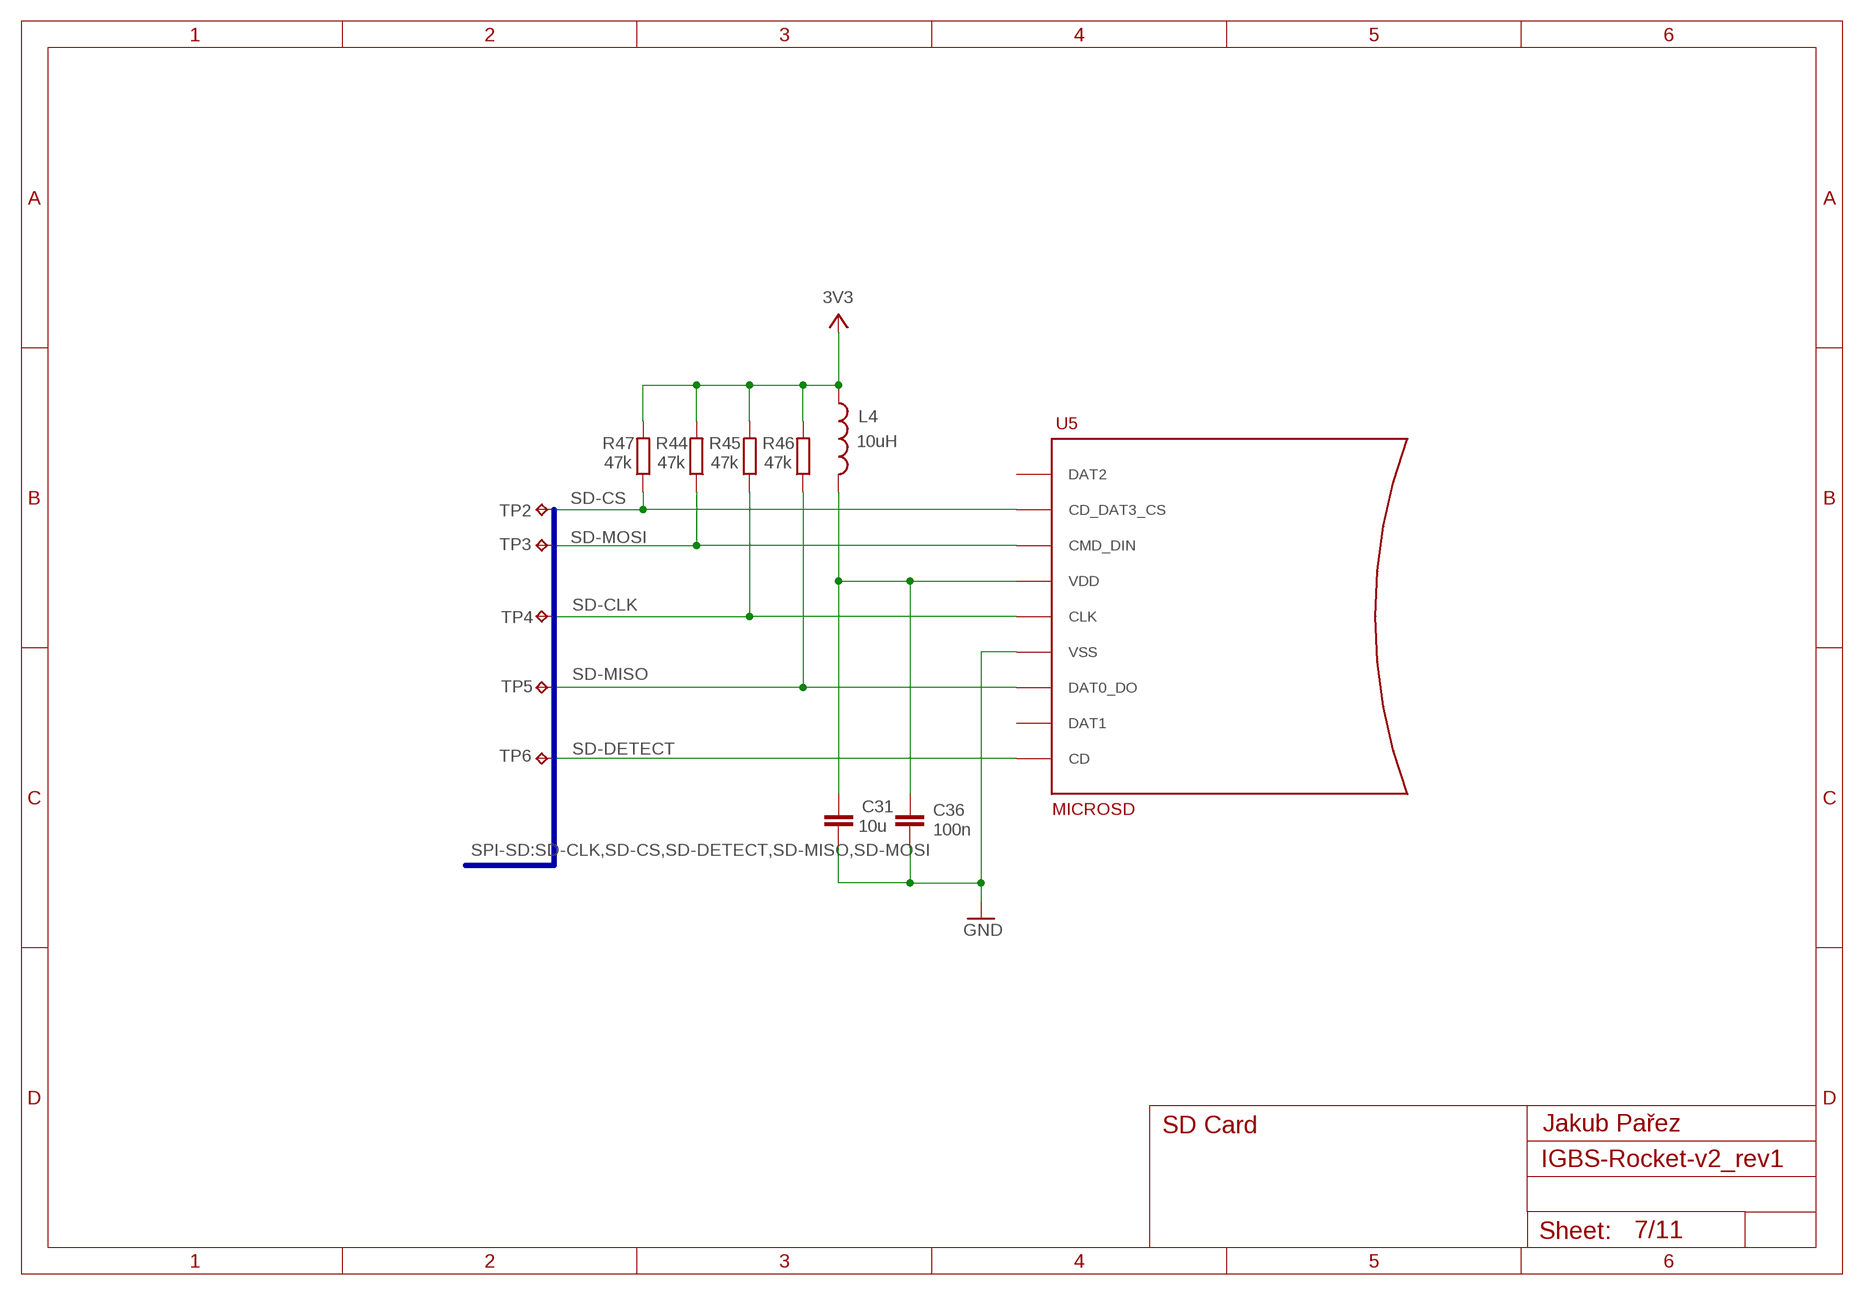
[diagram p6: schematic, sheet 7]

### Parts
C31  10u  10UF10V10%(0805)  [0805-CAP]
C36  100n  C-EUC0603K  [C0603K]
L4  10uH  INDUCTOR0805  [0805]
R44  47k  R-EU_R0603  [R0603]
R45  47k  R-EU_R0603  [R0603]
R46  47k  R-EU_R0603  [R0603]
R47  47k  R-EU_R0603  [R0603]
TP2  TPB1,27  [B1,27]
TP3  TPB1,27  [B1,27]
TP4  TPB1,27  [B1,27]
TP5  TPB1,27  [B1,27]
TP6  TPB1,27  [B1,27]
U5  MICROSD  MICROSD-PUSH-OUT  [MICROSD-PUSH-OUT]

### Nets
3V3-SD: C31.1 C36.1 L4.2 U5.4(VDD)
GND: C31.2 C36.2 U5.6(VSS) U5.G1(VSS) U5.G2(VSS) U5.G3(VSS) U5.G4(VSS) ; also sheet 1,2,3,4,5,6,8,10
SD-CLK: R45.1 TP4.TP U5.5(CLK) ; also sheet 1
SD-CS: R47.1 TP2.TP U5.2(CD_DAT3_CS) ; also sheet 1
SD-DETECT: TP6.TP U5.CD ; also sheet 1
SD-MISO: R46.1 TP5.TP U5.7(DAT0_DO) ; also sheet 1
SD-MOSI: R44.1 TP3.TP U5.3(CMD_DIN) ; also sheet 1
VCC: L4.1 R44.2 R45.2 R46.2 R47.2 ; supply symbol labelled 3V3 ; also sheet 10
Unconnected: U5.1(DAT2) U5.8(DAT1)

### Buses
SPI-SD:SD-CLK,SD-CS,SD-DETECT,SD-MISO,SD-MOSI

### Notes on the sheet
- SD Card | Jakub Pařez

## Sheet 8 of 11: WiFi
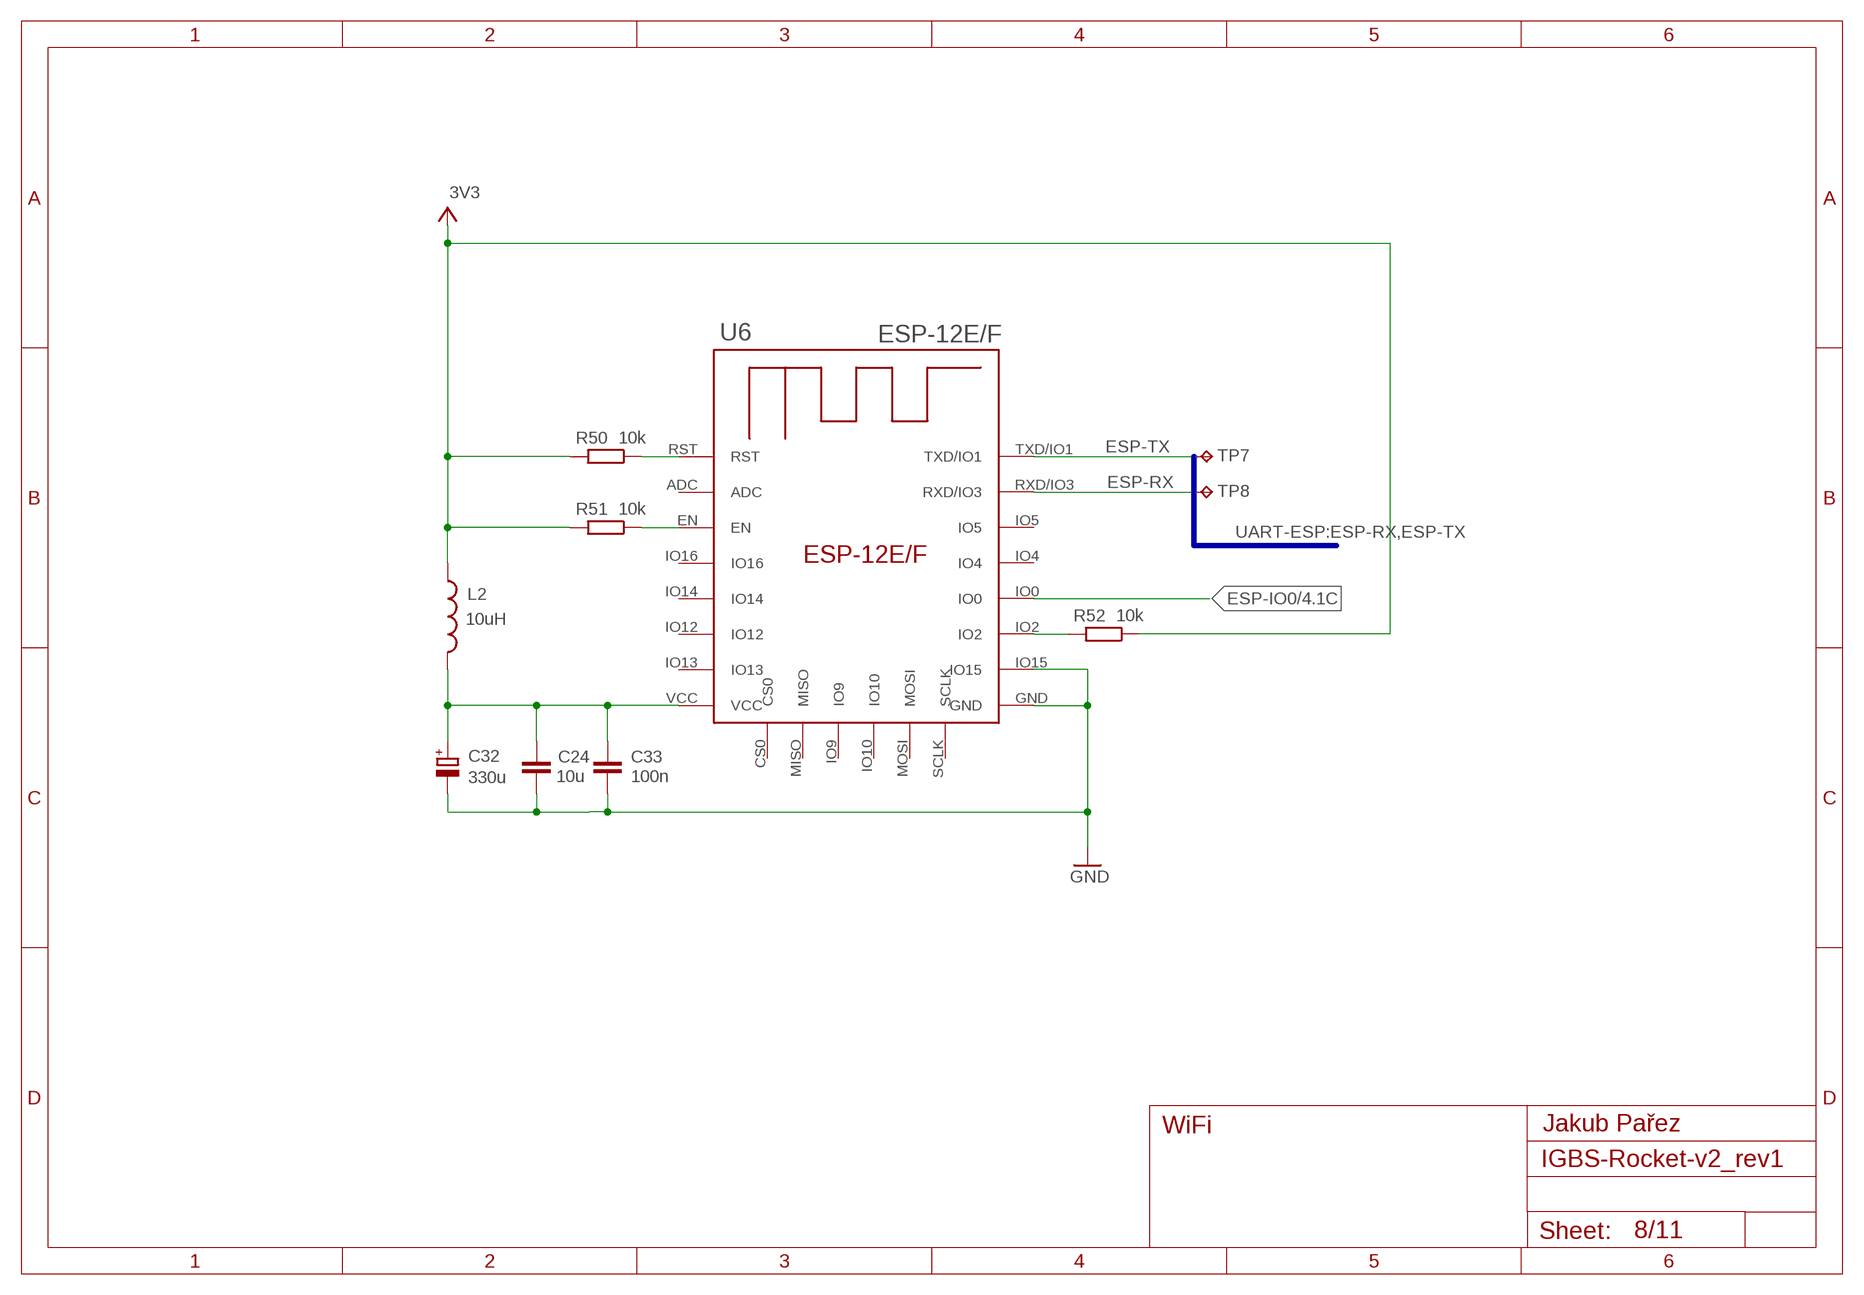
[diagram p7: schematic, sheet 8]

### Parts
C24  10u  10UF10V10%(0805)  [0805-CAP]
C32  330u  CPOL-EUE2.5-7  [E2,5-7]
C33  100n  C-EUC0603K  [C0603K]
L2  10uH  INDUCTOR0805  [0805]
R50  10k  R-EU_R0603  [R0603]
R51  10k  R-EU_R0603  [R0603]
R52  10k  R-EU_R0603  [R0603]
TP7  TPB1,27  [B1,27]
TP8  TPB1,27  [B1,27]
U6  ESP-12E/F  [ESP-12E]

### Nets
3V3: L2.1 R50.2 R51.2 R52.1 ; also sheet 1,2,3,4,5,6,9,10
5V-ESP: C24.1 C32.+ C33.1 L2.2 U6.VCC
ESP-IO0: U6.IO0 ; also sheet 4
ESP-RX: TP8.TP U6.RXD/IO3 ; also sheet 1
ESP-TX: TP7.TP U6.TXD/IO1 ; also sheet 1
GND: C24.2 C32.- C33.2 U6.GND U6.IO15 ; also sheet 1,2,3,4,5,6,7,10
N$47: R50.1 U6.RST
N$48: R51.1 U6.EN
N$50: R52.2 U6.IO2
Unconnected: U6.ADC U6.CS0 U6.IO4 U6.IO5 U6.IO9 U6.IO10 U6.IO12 U6.IO13 U6.IO14 U6.IO16 U6.MISO U6.MOSI U6.SCLK

### Buses
UART-ESP:ESP-RX,ESP-TX

### Notes on the sheet
- WiFi | Jakub Pařez

## Sheet 9 of 11: Gyro
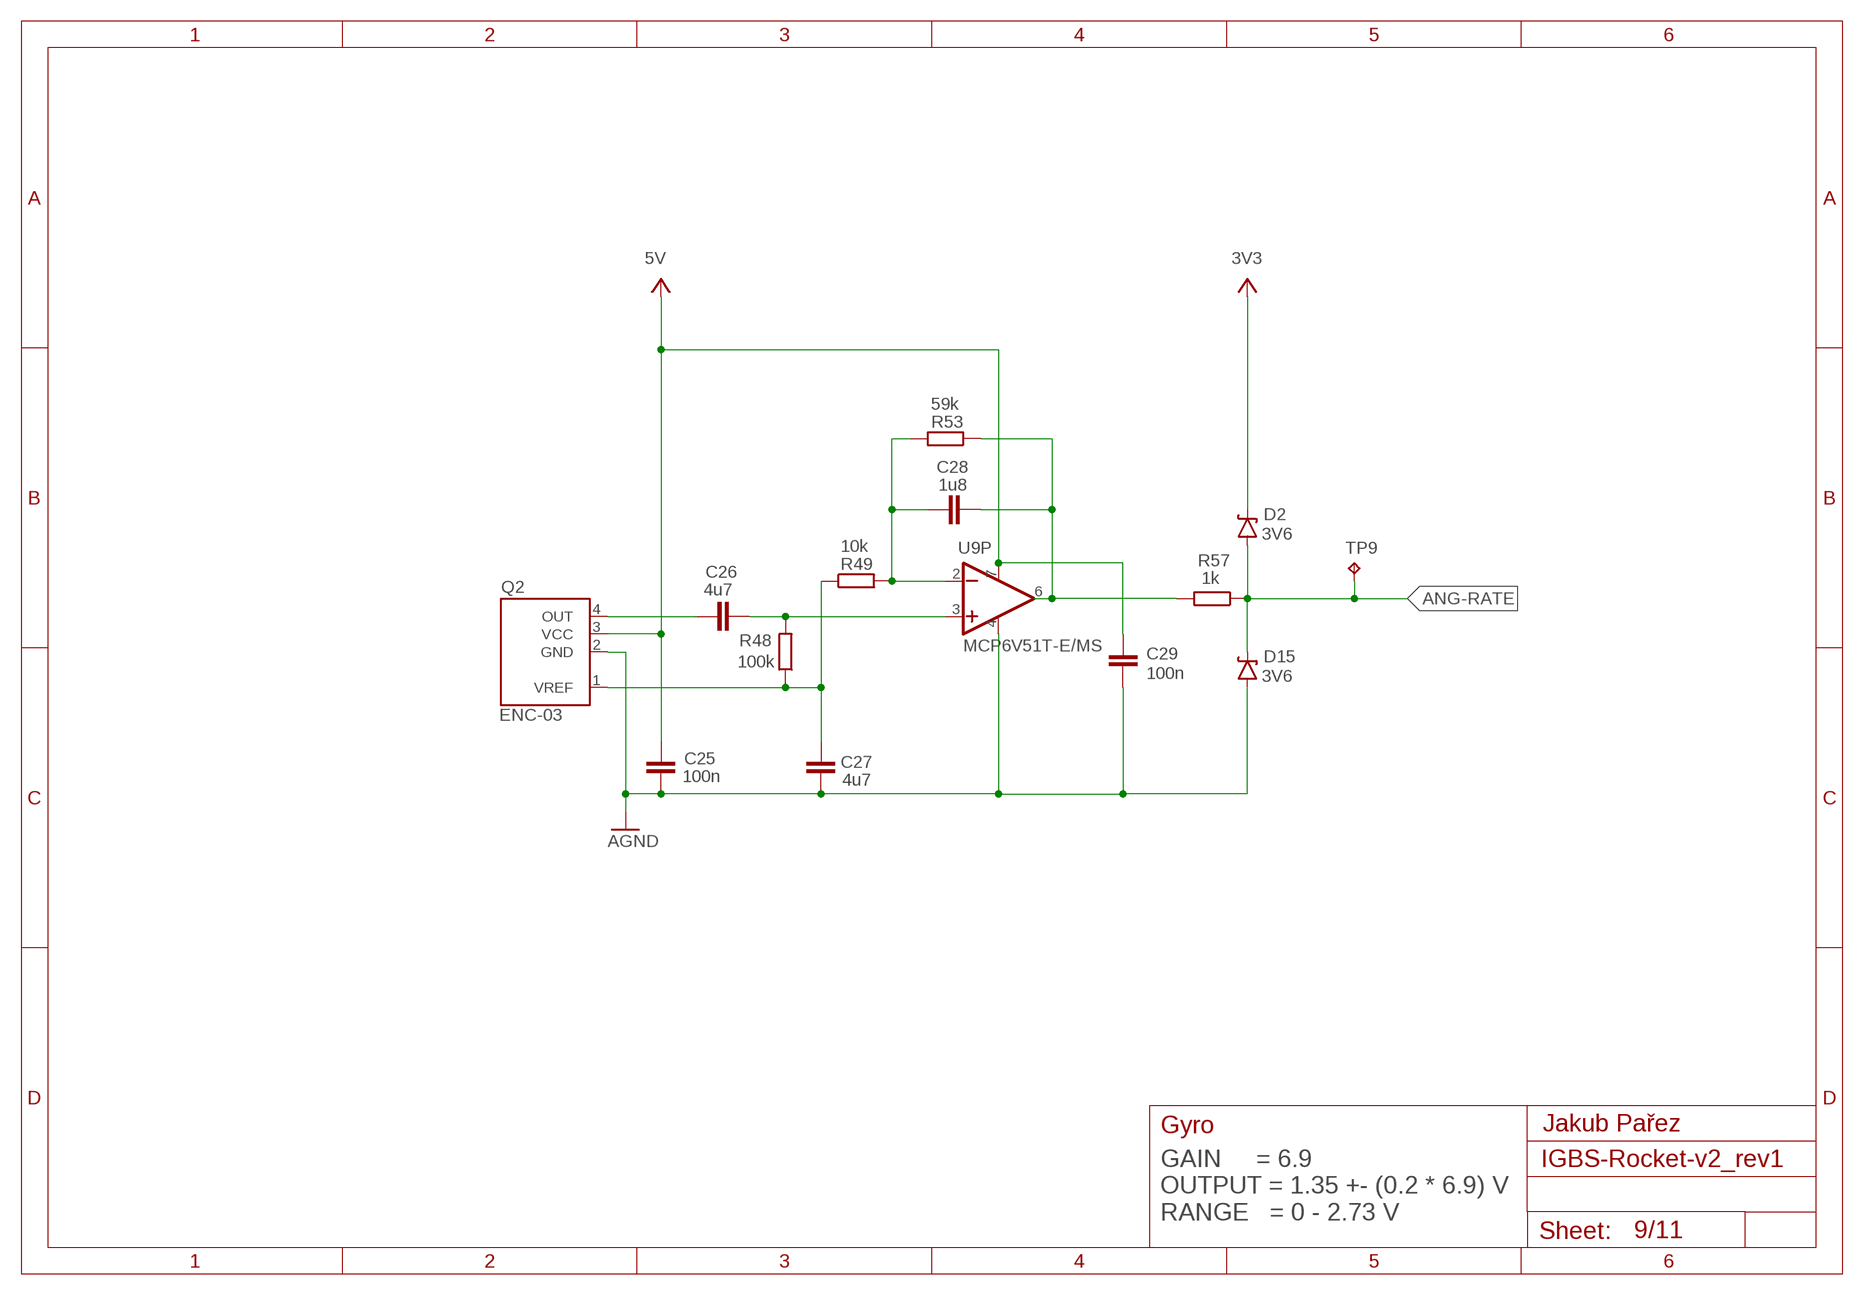
[diagram p8: schematic, sheet 9]

### Parts
C25  100n  C-EUC0603K  [C0603K]
C26  4u7  C-EUC0805K  [C0805K]
C27  4u7  C-EUC0805K  [C0805K]
C28  1u8  C-EUC0805K  [C0805K]
C29  100n  C-EUC0603K  [C0603K]
D2  3V6  DIODE-ZENER16V  [SOD-123]
D15  3V6  DIODE-ZENER16V  [SOD-123]
Q2  ENC-03  ENC-03RC  [ENC-03RC]
R48  100k  R-EU_R0603  [R0603]
R49  10k  R-EU_R0603  [R0603]
R53  59k  R-EU_R0603  [R0603]
R57  1k  R-EU_R0603  [R0603]
TP9  TPB1,27  [B1,27]
U9  MCP6V51T-E/MS  MCP6V51T-E/MSMSOP8_MS_MCH  [MSOP8_MS_MCH]

### Nets
3V3: D2.C ; also sheet 1,2,3,4,5,6,8,10
5V: C25.2 C29.2 Q2.3(VCC) U9.7(P:VCC) ; also sheet 4,5,6,10,11
AGND: C25.1 C27.2 C29.1 D15.A Q2.2(GND) U9.4(P:GND) ; also sheet 2,5,6,11
ANG-RATE: D2.A D15.C R57.1 TP9.TP ; also sheet 1
ANG-RATE2: C28.2 R53.1 R57.2 U9.6(P:OUT)
N$45: C26.2 Q2.4(OUT)
N$46: C26.1 R48.2 U9.3(P:+)
N$49: C27.1 Q2.1(VREF) R48.1 R49.1
N$51: C28.1 R49.2 R53.2 U9.2(P:-)
Unconnected: U9.1(NC1) U9.5(NC2) U9.8(NC3)

### Notes on the sheet
- Gyro | Jakub Pařez
- GAIN     = 6.9
  OUTPUT = 1.35 +- (0.2 * 6.9) V
  RANGE   = 0 - 2.73 V

## Sheet 10 of 11: Modules
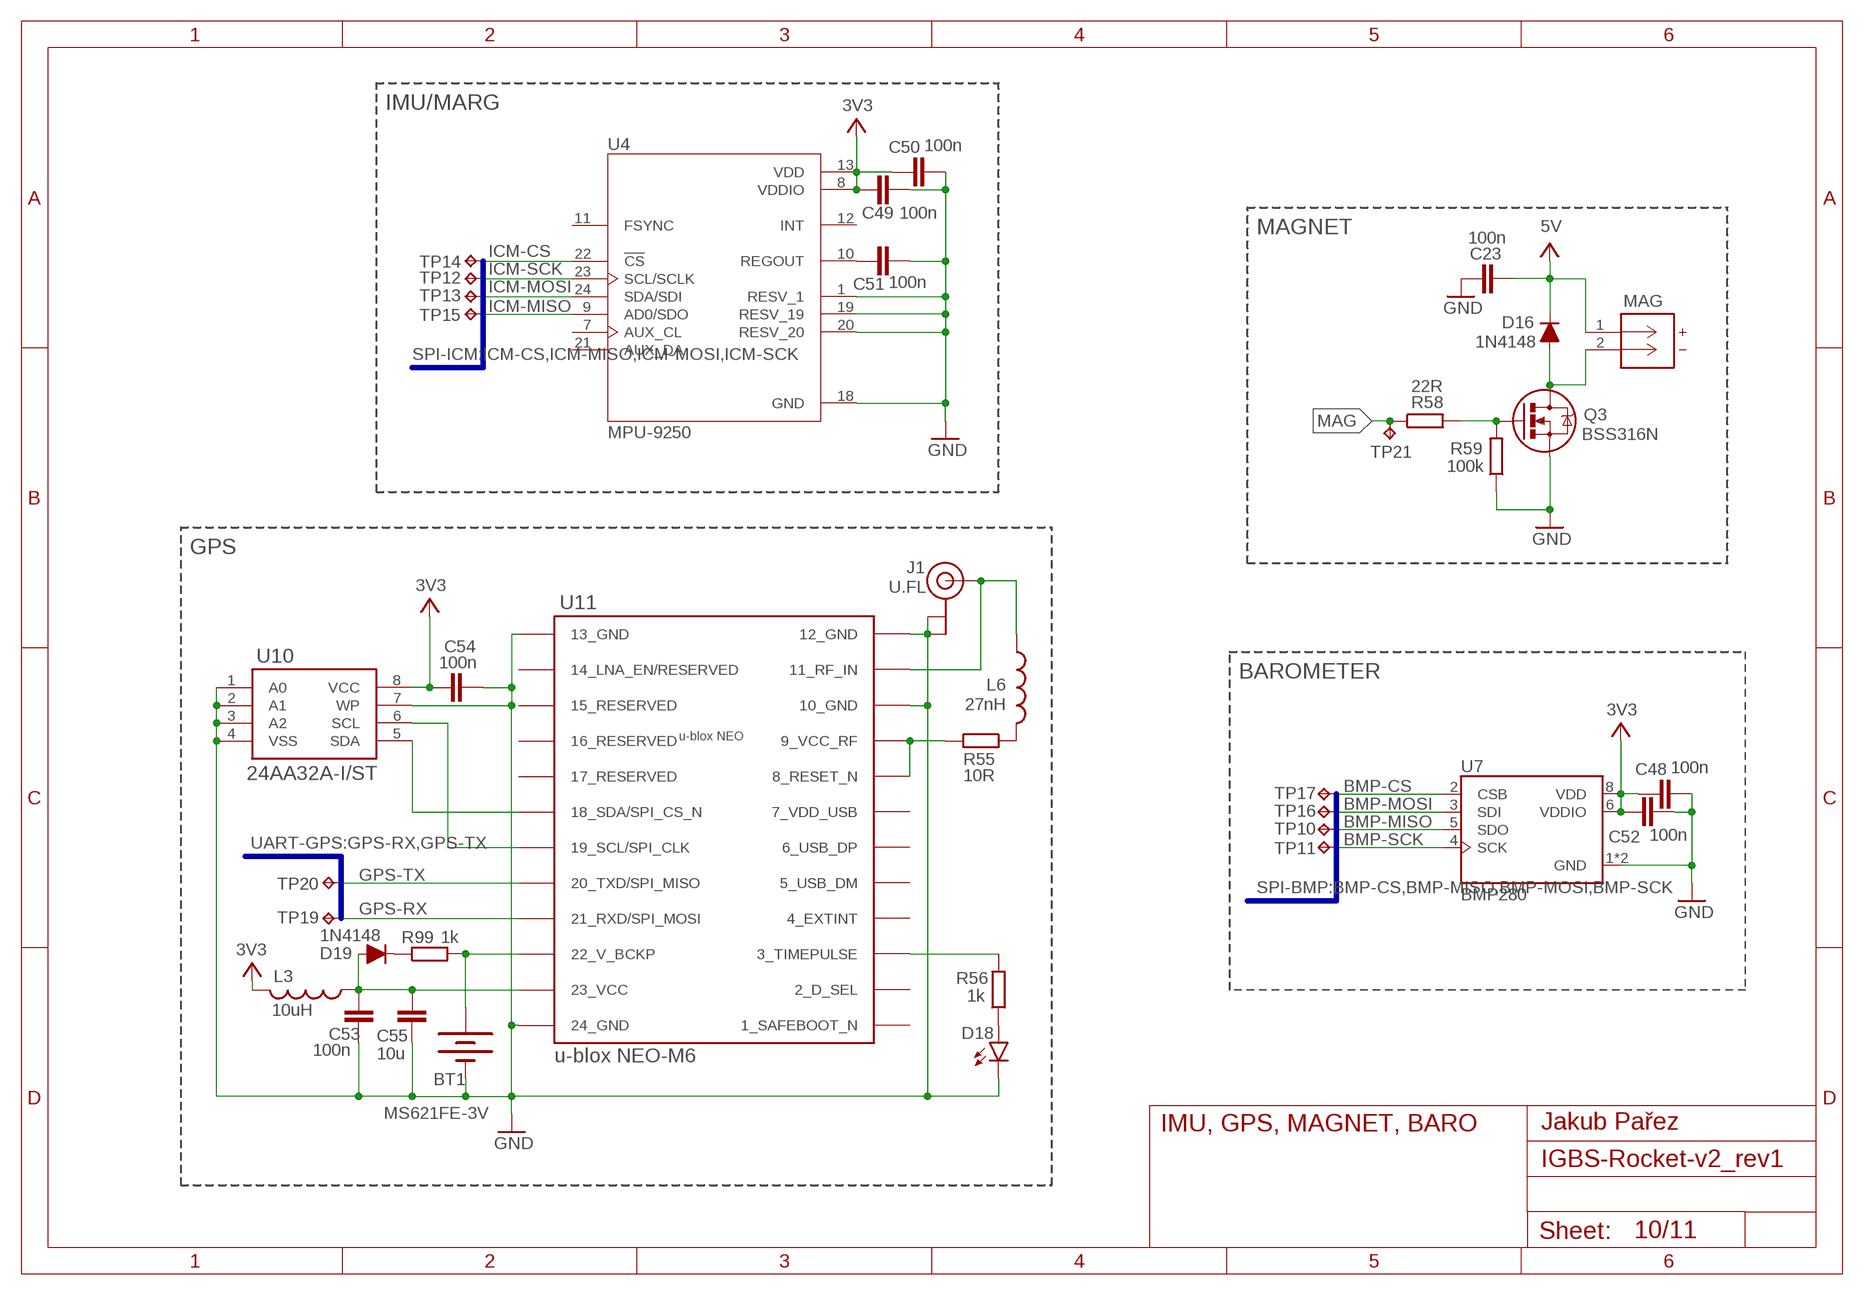
[diagram p9: schematic, sheet 10]

### Parts
BT1  MS621FE-3V  BATTERY-6.8MM_SMD  [BATTCON-6.8MM]
C23  100n  C-EUC0603K  [C0603K]
C48  100n  C-EUC0603K  [C0603K]
C49  100n  C-EUC0603K  [C0603K]
C50  100n  C-EUC0603K  [C0603K]
C51  100n  C-EUC0603K  [C0603K]
C52  100n  C-EUC0603K  [C0603K]
C53  100n  C-EUC0603K  [C0603K]
C54  100n  C-EUC0603K  [C0603K]
C55  10u  10UF10V10%(0805)  [0805-CAP]
D16  1N4148  DIODESOD123  [SOD-123]
D18  GREEN  LED-GREEN1206  [LED-1206]
D19  1N4148  DIODESOD123  [SOD-123]
J1  U.FL  [U.FL]
L3  10uH  INDUCTOR0805  [0805]
L6  27nH  INDUCTOR0402  [C0402]
MAG  S2B-XH-A(LF)(SN)CONN_S2B-XH-A_JST  [CONN_S2B-XH-A_JST]
Q3  BSS316N  MOSFET-NCHANNELBSS123LT1G  [SOT23-3]
R55  10R  R-EU_R0603  [R0603]
R56  1k  R-EU_R0603  [R0603]
R58  22R  R-EU_R0603  [R0603]
R59  100k  R-EU_R0603  [R0603]
R99  1k  R-EU_R0603  [R0603]
TP10  TPB1,27  [B1,27]
TP11  TPB1,27  [B1,27]
TP12  TPB1,27  [B1,27]
TP13  TPB1,27  [B1,27]
TP14  TPB1,27  [B1,27]
TP15  TPB1,27  [B1,27]
TP16  TPB1,27  [B1,27]
TP17  TPB1,27  [B1,27]
TP19  TPB1,27  [B1,27]
TP20  TPB1,27  [B1,27]
TP21  TPB1,27  [B1,27]
U4  MPU-9250  [QFN40P300X300X105-24N]
U7  BMP280  [XDCR_BMP280]
U10  24AA32A-I/ST  24AA32A-I/STTSSOP8_MC_MCH  [TSSOP8_MC_MCH]
U11  u-blox NEO-M6  NEO-M8  [NEO-M8]

### Nets
3V3: C48.2 C49.2 C50.2 C52.2 L3.2 U4.8(VDDIO) U4.13(VDD) U7.6(VDDIO) U7.8(VDD) ; also sheet 1,2,3,4,5,6,8,9
5V: C23.1 D16.C MAG.1 ; also sheet 4,5,6,9,11
5V-MAG: D16.A MAG.2 Q3.3(D)
BMP-CS: TP17.TP U7.2(CSB) ; also sheet 1
BMP-MISO: TP10.TP U7.5(SDO) ; also sheet 1
BMP-MOSI: TP16.TP U7.3(SDI) ; also sheet 1
BMP-SCK: TP11.TP U7.4(SCK) ; also sheet 1
GND: BT1.- C23.2 C48.1 C49.1 C50.1 C51.1 C52.1 C53.2 C54.2 C55.2 D18.C J1.P$1(GND) J1.P$2(GND) Q3.2(S) R59.1 U4.1(RESV_1) U4.18(GND) U4.19(RESV_19) U4.20(RESV_20) U7.1(GND) U7.7(GND) U10.1(A0) U10.2(A1) U10.3(A2) U10.4(VSS) U10.7(WP) U11.10(10_GND) U11.12(12_GND) U11.13(13_GND) U11.24(24_GND) ; also sheet 1,2,3,4,5,6,7,8
GPS-RF-IN: J1.P$3(SIGNAL) L6.1 U11.11(11_RF_IN)
GPS-RX: TP19.TP U11.21(21_RXD/SPI_MOSI) ; also sheet 1
GPS-TX: TP20.TP U11.20(20_TXD/SPI_MISO) ; also sheet 1
GPS-VBCKP: BT1.+ R99.2 U11.22(22_V_BCKP)
GPS-VBCKP2: D19.C R99.1
GPS-VCC: C53.1 C55.1 D19.A L3.1 U11.23(23_VCC)
GPS-VCC-RF: R55.2 U11.8(8_RESET_N) U11.9(9_VCC_RF)
ICM-CS: TP14.TP U4.22(!CS) ; also sheet 1
ICM-MISO: TP15.TP U4.9(AD0/SDO) ; also sheet 1
ICM-MOSI: TP13.TP U4.24(SDA/SDI) ; also sheet 1
ICM-SCK: TP12.TP U4.23(SCL/SCLK) ; also sheet 1
MAG: R58.1 TP21.TP ; also sheet 1
N$44: Q3.1(G) R58.2 R59.2
N$69: U10.6(SCL) U11.19(19_SCL/SPI_CLK)
N$73: U10.5(SDA) U11.18(18_SDA/SPI_CS_N)
N$74: C51.2 U4.10(REGOUT)
N$78: D18.A R56.1
N$79: L6.2 R55.1
N$80: R56.2 U11.3(3_TIMEPULSE)
VCC: C54.1 U10.8(VCC) ; supply symbol labelled 3V3 ; also sheet 7
Unconnected: U4.7(AUX_CL) U4.11(FSYNC) U4.12(INT) U4.21(AUX_DA) U11.1(1_SAFEBOOT_N) U11.2(2_D_SEL) U11.4(4_EXTINT) U11.5(5_USB_DM) U11.6(6_USB_DP) U11.7(7_VDD_USB) U11.14(14_LNA_EN/RESERVED) U11.15(15_RESERVED) U11.16(16_RESERVED) U11.17(17_RESERVED)

### Buses
UART-GPS:GPS-RX,GPS-TX
SPI-ICM:ICM-CS,ICM-MISO,ICM-MOSI,ICM-SCK
SPI-BMP:BMP-CS,BMP-MISO,BMP-MOSI,BMP-SCK

### Notes on the sheet
- IMU/MARG
- MAGNET
- GPS
- BAROMETER
- IMU, GPS, MAGNET, BARO | Jakub Pařez

## Sheet 11 of 11: Strain Gauges
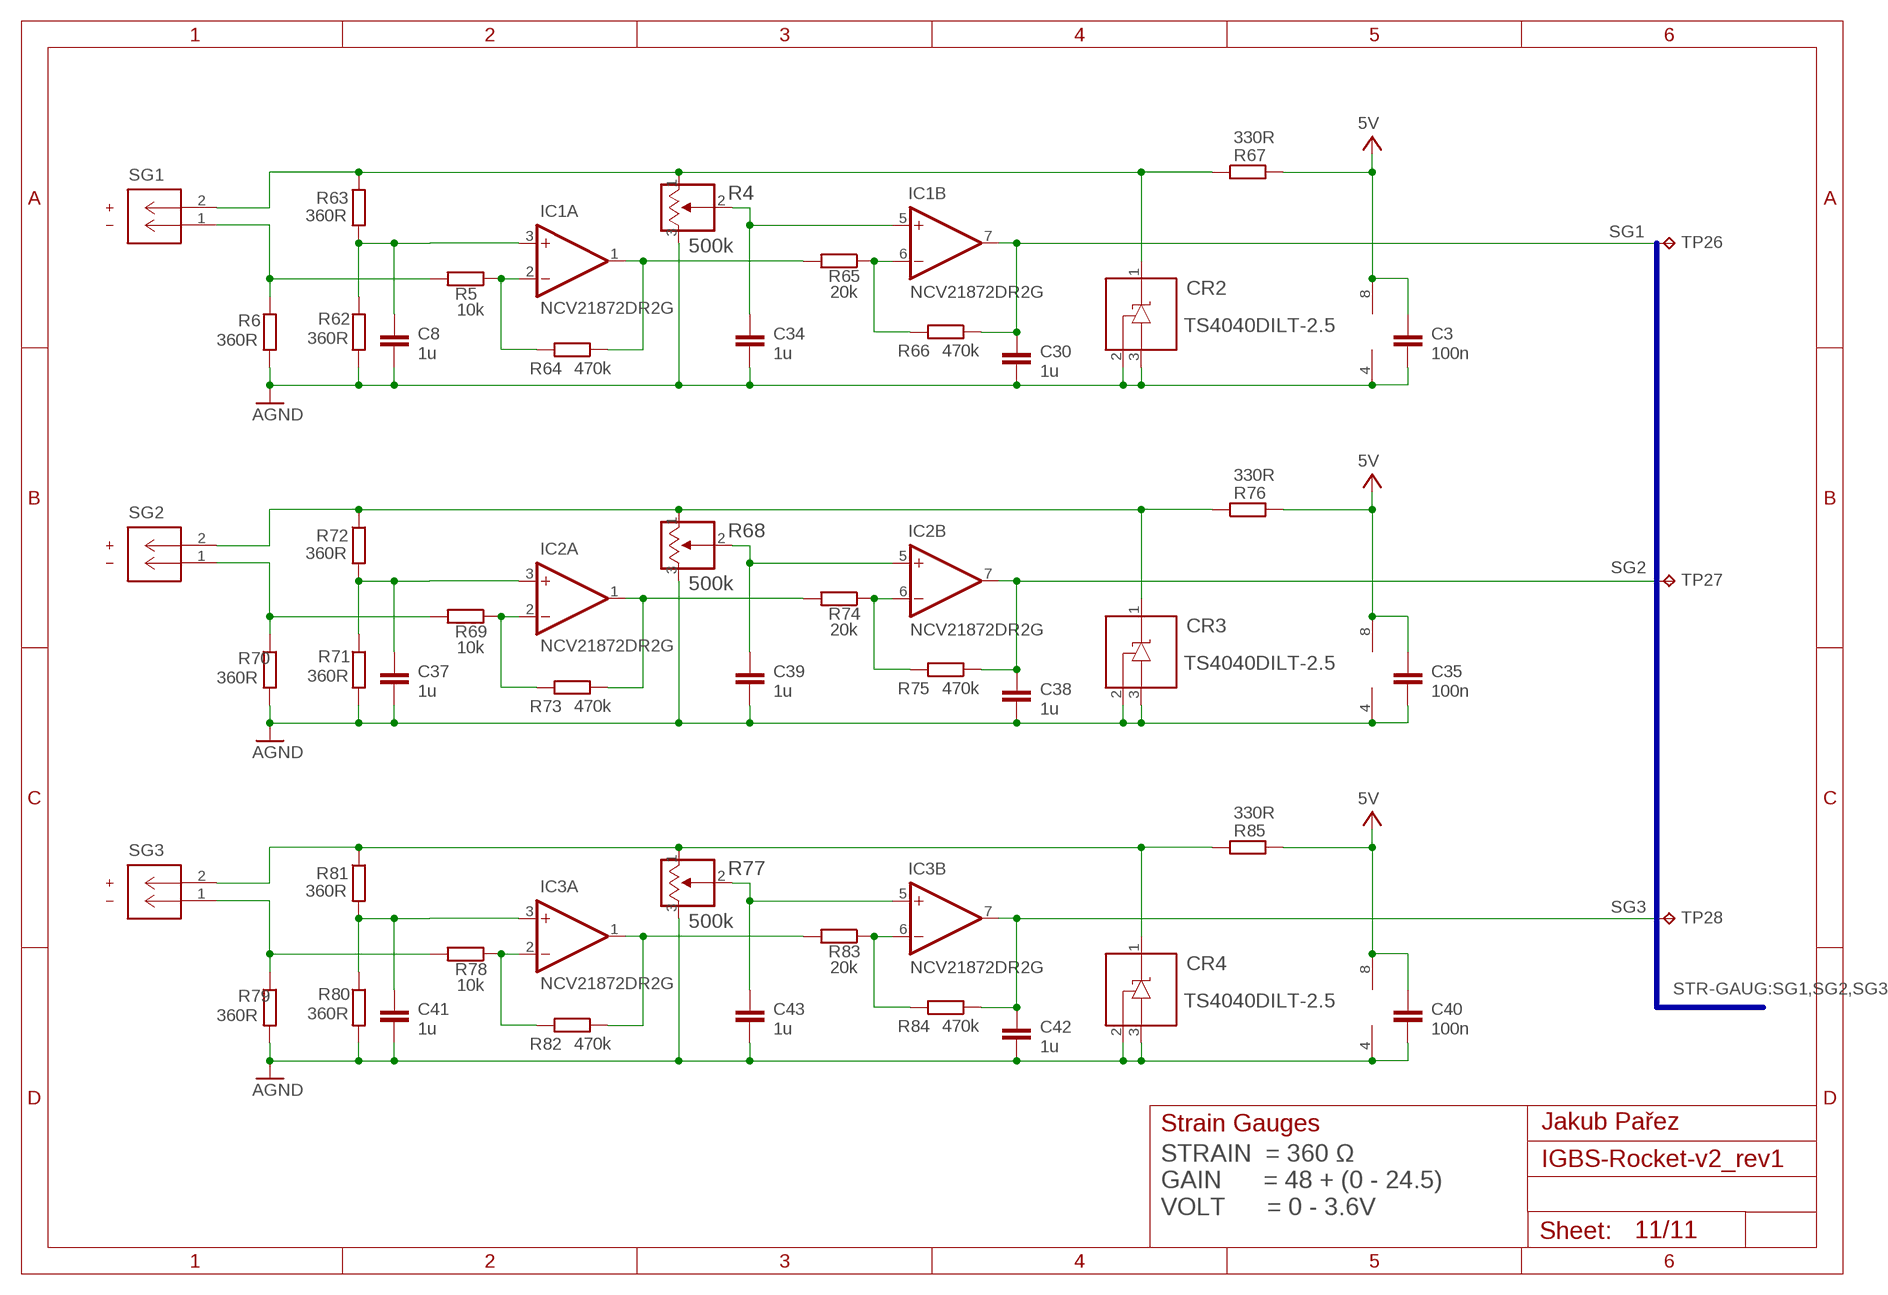
[diagram p10: schematic, sheet 11]

### Parts
C3  100n  C-EUC0603K  [C0603K]
C8  1u  C-EUC0603K  [C0603K]
C30  1u  C-EUC0603K  [C0603K]
C34  1u  C-EUC0603K  [C0603K]
C35  100n  C-EUC0603K  [C0603K]
C37  1u  C-EUC0603K  [C0603K]
C38  1u  C-EUC0603K  [C0603K]
C39  1u  C-EUC0603K  [C0603K]
C40  100n  C-EUC0603K  [C0603K]
C41  1u  C-EUC0603K  [C0603K]
C42  1u  C-EUC0603K  [C0603K]
C43  1u  C-EUC0603K  [C0603K]
CR2  TS4040DILT-2.5  TL431QDBZR,215SOT23_TO-236AB_NEX  [SOT23_TO-236AB_NEX]
CR3  TS4040DILT-2.5  TL431QDBZR,215SOT23_TO-236AB_NEX  [SOT23_TO-236AB_NEX]
CR4  TS4040DILT-2.5  TL431QDBZR,215SOT23_TO-236AB_NEX  [SOT23_TO-236AB_NEX]
IC1  NCV21872DR2G  LM358D  [SO08]
IC2  NCV21872DR2G  LM358D  [SO08]
IC3  NCV21872DR2G  LM358D  [SO08]
R4  500k  PVG3A103C01R00RES_C01R00  [RES_C01R00]
R5  10k  R-EU_R0603  [R0603]
R6  360R  R-EU_R0603  [R0603]
R62  360R  R-EU_R0603  [R0603]
R63  360R  R-EU_R0603  [R0603]
R64  470k  R-EU_R0603  [R0603]
R65  20k  R-EU_R0603  [R0603]
R66  470k  R-EU_R0603  [R0603]
R67  330R  R-EU_R0603  [R0603]
R68  500k  PVG3A103C01R00RES_C01R00  [RES_C01R00]
R69  10k  R-EU_R0603  [R0603]
R70  360R  R-EU_R0603  [R0603]
R71  360R  R-EU_R0603  [R0603]
R72  360R  R-EU_R0603  [R0603]
R73  470k  R-EU_R0603  [R0603]
R74  20k  R-EU_R0603  [R0603]
R75  470k  R-EU_R0603  [R0603]
R76  330R  R-EU_R0603  [R0603]
R77  500k  PVG3A103C01R00RES_C01R00  [RES_C01R00]
R78  10k  R-EU_R0603  [R0603]
R79  360R  R-EU_R0603  [R0603]
R80  360R  R-EU_R0603  [R0603]
R81  360R  R-EU_R0603  [R0603]
R82  470k  R-EU_R0603  [R0603]
R83  20k  R-EU_R0603  [R0603]
R84  470k  R-EU_R0603  [R0603]
R85  330R  R-EU_R0603  [R0603]
SG1  S3B-XH-A  S2B-XH-A(LF)(SN)CONN_S2B-XH-A_JST  [CONN_S2B-XH-A_JST]
SG2  S3B-XH-A  S2B-XH-A(LF)(SN)CONN_S2B-XH-A_JST  [CONN_S2B-XH-A_JST]
SG3  S3B-XH-A  S2B-XH-A(LF)(SN)CONN_S2B-XH-A_JST  [CONN_S2B-XH-A_JST]
TP26  TPB1,27  [B1,27]
TP27  TPB1,27  [B1,27]
TP28  TPB1,27  [B1,27]

### Nets
5V: C3.2 C35.2 C40.2 IC1.8(P:V+) IC2.8(P:V+) IC3.8(P:V+) R67.2 R76.2 R85.2 ; also sheet 4,5,6,9,10
AGND: C3.1 C8.1 C30.1 C34.1 C35.1 C37.1 C38.1 C39.1 C40.1 C41.1 C42.1 C43.1 CR2.2 CR2.3 CR3.2 CR3.3 CR4.2 CR4.3 IC1.4(P:V-) IC2.4(P:V-) IC3.4(P:V-) R4.3 R6.2 R62.2 R68.3 R70.2 R71.2 R77.3 R79.2 R80.2 ; also sheet 2,5,6,9
N$2: R69.2 R70.1 SG2.1
N$11: R5.2 R6.1 SG1.1
N$12: C8.2 IC1.3(A:+IN) R62.1 R63.2
N$20: C37.2 IC2.3(A:+IN) R71.1 R72.2
N$24: IC1.2(A:-IN) R5.1 R64.2
N$25: IC1.1(A:OUT) R64.1 R65.2
N$26: IC1.6(B:-IN) R65.1 R66.2
N$53: C34.2 IC1.5(B:+IN) R4.2
N$54: CR2.1 R4.1 R63.1 R67.1 SG1.2
N$55: IC2.2(A:-IN) R69.1 R73.2
N$56: IC2.1(A:OUT) R73.1 R74.2
N$57: IC2.6(B:-IN) R74.1 R75.2
N$58: C39.2 IC2.5(B:+IN) R68.2
N$60: CR3.1 R68.1 R72.1 R76.1 SG2.2
N$61: R78.2 R79.1 SG3.1
N$62: C41.2 IC3.3(A:+IN) R80.1 R81.2
N$63: IC3.2(A:-IN) R78.1 R82.2
N$64: IC3.1(A:OUT) R82.1 R83.2
N$65: IC3.6(B:-IN) R83.1 R84.2
N$66: C43.2 IC3.5(B:+IN) R77.2
N$68: CR4.1 R77.1 R81.1 R85.1 SG3.2
SG1: C30.2 IC1.7(B:OUT) R66.1 TP26.TP ; also sheet 1
SG2: C38.2 IC2.7(B:OUT) R75.1 TP27.TP ; also sheet 1
SG3: C42.2 IC3.7(B:OUT) R84.1 TP28.TP ; also sheet 1

### Buses
STR-GAUG:SG1,SG2,SG3

### Notes on the sheet
- Strain Gauges | Jakub Pařez
- STRAIN  = 360 Ω
  GAIN      = 48 + (0 - 24.5)
  VOLT      = 0 - 3.6V

## Library data of the parts
3V3 5V GND I2C UART = pinhead2-nopin:PINHD-1X2: PIN HEADER
12V-CAM MAG SG1-SG3 = jst-XH2:S2B-XH-A(LF)(SN); COPYRIGHT: Copyright (C) 2022 Ultra Librarian. All rights reserved.; MANUFACTURER_PART_NUMBER: S2B-XH-A(LF)(SN); MFR_NAME: JST
ADC SPI = pinhead2-nopin:PINHD-1X3: PIN HEADER
BT1 = SparkFun-Batteries:BATTERY: Battery - Single Cell A variety of battery chemistries, sizes, and footprints. Device List: 20MM_PTH - Coin Cell Battery Holder - 20mm (PTH) <https://www.sparkfun.com/products/783> 20MM_PTH_KIT- Coin Cell battery Holder - 20 mm (PTH) <http://www.sparkfun.com/products/783>kit version with special mask 6.8MM_PTH - Coin Cell Battery Holder - 6.8MM(SMD) <https://www.digikey.com/product-detail/en/seiko-instruments/MS621FE-FL11E/728-1057-ND/1889208?WT.srch=1&gclid=CNOQ5a6LzdQCFZS2wAodXCkE0g> 12MM_SMD - Coin Cell Battery Holder - 12mm (SMD) <https://www.sparkfun.com/products/10592> 12MM_PTH - Coin Cell Battery Holder - 12mm (PTH) <https://www.sparkfun.com/products/7948> 20MM_SMD - 20mm Coin Cell Battery Holder (SMD) (2 legs) Used on the Big Time Watch Kit <https://www.sparkfun.com/products/11734> 20MM_SMD_4LEGS - Coin Cell Battery Holder - 20mm (SMD) <https://www.sparkfun.com/products/11892> 20MM_SMD_4LEGS_OVERPASTE - Coin Cell Battery Holder - 20mm (SMD) <https://www.sparkfun.com/products/11892> (Over-paste on the legs) 24.5MM_PTH - Coin Cell Battery Holder - 24.5mm (PTH) <https://www.sparkfun.com/products/8863> 9V - 9V Battery Holder - PC Mount Used on the SparkFun SparkPunk Sound Kit <https://www.sparkfun.com/products/11177> and SparkFun SparkPunk Sequencer Kit <https://www.sparkfun.com/products/12707> 18650 - Battery Holder - 18650 (PTH) <https://www.sparkfun.com/products/13113> AA - Battery Holder - 1xAA (PTH) <https://www.sparkfun.com/products/7949> AAA - Battery Holder - 1xAAA (PTH) <https://www.sparkfun.com/products/12718> AA_KIT - Battery Holder - 1xAA (PTH) <https://www.sparkfun.com/products/7949> Special kit package - pads only have exposed copper on one side of the board. AAA_KIT - Battery Holder - 1xAAA (PTH) <https://www.sparkfun.com/products/12718> Special kit package - pads only have exposed copper on one side of the board.; PROD_ID: BATT-13734; VALUE: 6.8MM_COIN_CELL
BTN1 RESET = switch_btn:B3FS-1000; COPYRIGHT: Copyright (C) 2022 Ultra Librarian. All rights reserved.; MANUFACTURER_PART_NUMBER: B3FS-1000; MFR_NAME: Omron
BUZZER = SparkFun-Electromechanical:BUZZER: Buzzer 12mm Spark Fun Electronics SKU : Comp-Buzzer
C1 C6 C10 C32 = rcl2:CPOL-EU: POLARIZED CAPACITOR, European symbol
C2 C5 C7 C9 C19 C24 C31 C44 C46 C55-C57 = SparkFun-Capacitors:10UF10V10%(0805): CAP-11330; PROD_ID: CAP-11330
C3 C4 C8 C11-C18 C20-C23 C25-C30 C33-C43 C45 C47-C54 = rcl2:C-EU: CAPACITOR, European symbol
CR1 = ldo:LD1117DT50TR
CR2-CR4 = ref:TL431QDBZR,215; COPYRIGHT: Copyright (C) 2022 Ultra Librarian. All rights reserved.; MANUFACTURER_PART_NUMBER: TL431QDBZR,215; MFR_NAME: Nexperia
CR5 = ldo:AZ2185D
CR6 = diode2:SS12-E3/5AT; COPYRIGHT: Copyright (C) 2022 Ultra Librarian. All rights reserved.; MANUFACTURER_PART_NUMBER: SS12-E3/5AT; MFR_NAME: Vishay
D1 D3-D6 D8-D13 D17 D18 = leds:LED-GREEN: Various green LEDs Green LEDs used in SFE Production 0603- DIO-00821 LARGE- DIO-00862 LILYPAD- DIO-09910; PROD_ID: DIO-00862
D2 D14 D15 = SparkFun-DiscreteSemi:DIODE-ZENER: Zener Diode Production Part - 8199 3.4V Zener Voltage; PROD_ID: DIO-12440; VALUE: 16V
D7 = SparkFun-DiscreteSemi:TVS: Transient voltage suppressor- prevents ESD on inputs.
D16 D19 = SparkFun-DiscreteSemi:DIODE: Diode These are standard reverse protection diodes and small signal diodes. SMA package can handle up to about 1A. SOD-323 can handle about 200mA. What the SOD-323 package when ordering, there are some mfgs out there that are 5-pin packages.
GPIO = pinhead2-nopin:PINHD-1X4: PIN HEADER
H1-H6 = holes3:MOUNT-PAD-ROUND: MOUNTING PAD, round
IC1-IC3 = opamps:LM358: OP AMP also LM158; LM258; LM2904 Source: http://cache.national.com/ds/LM/LM158.pdf
J1 = SparkFun-Connectors:U.FL: SMD antenna connector- WRL-09144; PROD_ID: CONN-09193
L1-L4 L6 = rcl2:INDUCTOR: Inductors Basic Inductor/Choke - 0603 and 1206. Footprints are not proven and vary greatly between part numbers. INDUCTOR POWER 3.3UH 4.0A SMD 0.197" L x 0.197" W x 0.177" H (5.00mm x 5.00mm x 4.50mm)
L5 = rcl2:744373240047; COPYRIGHT: Copyright (C) 2022 Ultra Librarian. All rights reserved.; MANUFACTURER_PART_NUMBER: 744373240047; MFR_NAME: Wurth Electronics
MOV1 = varistor2:VARISTOR: VARISTOR
PIANO = switch_btn:A6FR-4101; COPYRIGHT: Copyright (C) 2022 Ultra Librarian. All rights reserved.; MANUFACTURER_PART_NUMBER: A6FR-4101; MFR_NAME: Omron
PPTC1 = SparkFun-Fuses:PPTC: Resettable Fuse PPTC Resettable Fuse. Really a sort of resistor with a polymeric positive temperature coefficient whose resistance increases dramatically with an increase in temperature. When heated by the power passing through the resistance rises causing the current to be limited, protecting the circuit. This is achieved by the transition of the polymer from a crystalline to an amorphous state where the conductive carbon separates breaking the conductive pathways found in the cool crystalline structure. When a PPTC cools back down it resumes conducting letting the circuit turn back on. SparkFun Products: SparkFun RedBoard - Programmed with Arduino <https://www.sparkfun.com/products/12757> Pro Micro - 5V/16MHz <https://www.sparkfun.com/products/12640> Arduino Pro 328 - 5V/16MHz <https://www.sparkfun.com/products/10915> MP3 Trigger <https://www.sparkfun.com/products/13720>; PROD_ID: RES-14313; VALUE: 6V/2A
PWR-A = jst-XH2:XT30: AMASS XT30 connector Store in Japan AMASS XT30 connector <https://szc.jp/ams-xt30>
PWR-B = jst-XH2:S2B-PH-K-S(LF)(SN); COPYRIGHT: Copyright (C) 2022 Ultra Librarian. All rights reserved.; MANUFACTURER_PART_NUMBER: S2B-PH-K-S(LF)(SN); MFR_NAME: JST
Q1 Q4 = transistor-npn:BC817*: NPN Transistor
Q2 = gyro:ENC-03RC: CRYSTAL
Q3 = SparkFun-DiscreteSemi:MOSFET-NCHANNEL: Common NMOSFET Parts MFG P/N Store ID Prod ID FDD8780 TRANS-09984 SI7820DN TRANS-11055 FDS6630A IC-08089 2N7002PW TRANS-11151 FQP30N06L COM-10213 TRANS-10060 BSS123LT1G TRANS-08345 BSS138 TRANS-00830 BS170 2N7000; PROD_ID: TRANS-08345
Q5 = SparkFun-DiscreteSemi:MOSFET-PCHANNEL: Generic PMOSFET IRLML2244 - TRANS-11153 (SOT-23 -20V -4.3A) (1.Gate 2.Source 3.Drain) FQP27P06 - COM-10349 <http://www.sparkfun.com/products/10349> (TO-220 -60V -27A) (1.Gate 2.Source 3.Drain); PROD_ID: TRANS-08285
R1-R3 R5-R67 R69-R76 R78-R89 R91-R99 = rcl2:R-EU_: RESISTOR, European symbol
R4 R68 R77 = trimmer:PVG3A103C01R00; COPYRIGHT: Copyright (C) 2022 Ultra Librarian. All rights reserved.; MANUFACTURER_PART_NUMBER: PVG3A103C01R00; MFR_NAME: Bourns Electronics
R90 = rcl2:R-EU_: RESISTOR, European symbol; SPICEPREFIX: R
SRV1-SRV3 = jst-XH2:S3B-XH-A(LF)(SN); COPYRIGHT: Copyright (C) 2022 Ultra Librarian. All rights reserved.; MANUFACTURER_PART_NUMBER: S3B-XH-A(LF)(SN); MFR_NAME: JST
SWD = pinhead2:PINHD-1X6: PIN HEADER
TP1-TP28 = testpad2:TP: Test pad
U1 = stm:STM32H750VBT6; COPYRIGHT: Copyright (C) 2022 Ultra Librarian. All rights reserved.; MANUFACTURER_PART_NUMBER: STM32H750VBT6; MFR_NAME: STMicroelectronics
U2 = linreg:LM317BD2TG
U3 = dc-dc:CS5171EDR8G; COPYRIGHT: Copyright (C) 2022 Ultra Librarian. All rights reserved.; MANUFACTURER_PART_NUMBER: CS5171EDR8G; MFR_NAME: onsemi
U4 = gyro:MPU-9250: Axis=3 Axis Gyro+3 Axis Accel+Compass. Pin For Pin With m; DESCRIPTION: SMD Gyroscope/Accelerometer/Magnetometer Sensor; 9-AXIS; DIGI-KEY_PART_NUMBER: 1428-1019-1-ND; DIGI-KEY_PURCHASE_URL: https://www.digikey.in/product-detail/en/tdk-invensense/MPU-9250/1428-1019-1-ND/4626450?utm_source=snapeda&utm_medium=aggregator&utm_campaign=symbol; MF: TDK InvenSense; MP: MPU-9250; NOTES: The center Exposed Pad (EP), for MPU devices is a No Connect (NC) pad. To avoid package stress, do not solder the EP to the PCB. Please refer to the document “AN-IVS-0002A-00”. As a result of these guidelines, the exposed pad has not been included on the PCB footprint. We’ve added a keep-out area under the exposed pad. Please don’t route traces or vias under the part, on the same side of the board; PACKAGE: QFN-24 TDK InvenSense
U5 = microsd:MICROSD-PUSH-OUT: T-Flash Push-Out Micro SD Card Reader 14.75mm x 14.5mm SMD with external pins
U6 = esp-12e-f:ESP-12E/F
U7 = gyro:BMP280: BMP280 Absolute Barometric Pressure Sensor for Battery Powered Devices 2 x 2.5mm; MANUFACTURER: Bosch; MP: BMP280; PART_REV: 1.19; STANDARD: MANUFACTURER RECOMMENDATIONS
U8 = opamps:LP324DRG4; COPYRIGHT: Copyright (C) 2022 Ultra Librarian. All rights reserved.; MANUFACTURER_PART_NUMBER: LP324DRG4; MFR_NAME: Texas Instruments
U9 = opamps:MCP6V51T-E/MS; COPYRIGHT: Copyright (C) 2022 Ultra Librarian. All rights reserved.; MANUFACTURER_PART_NUMBER: MCP6V51T-E/MS; MFR_NAME: Microchip
U10 = eeprom:24AA32A-I/ST; COPYRIGHT: Copyright (C) 2022 Ultra Librarian. All rights reserved.; MANUFACTURER_PART_NUMBER: 24AA32A-I/ST; MFR_NAME: Microchip
U11 = gps:NEO-M8: u-blox NEO GNSS module
U$1 = testpad2:SHORT
USB = usb:USB-MINIB: Mini-USB "B" connector with 5th pin broken out. Created new symbol breaking out 5th "ID" pin in mini/micro USB connector spec. See: http://en.wikipedia.org/wiki/Mini_usb#Cables. Uses same footprint as 4-pin symbol. Also added pins to connect to mounting / shield pads if required (probably not generally needed as signals aren't shielded once they leave the connector).; PROD_ID: CONN-08193
Y1 = SparkFun-Clocks:OSCILLATOR-16MHZ: 16 MHz 7x5mm Oscllator Frequency: 16MHz Frequency Stability: ±50ppm Operating Voltage: 3.3V Datasheet Example <http://www.futureelectronics.com/en/technologies/electromechanical/timing-devices/oscillators/Pages/9907304-FXO-HC735-16.aspx?IM=0> SparkFun MiniGen <https://www.sparkfun.com/products/11420>; PROD_ID: XTAL-11225; VALUE: 16MHz

## Net classes
0 default: width 0.203 mm, drill 0.254 mm, clearance 0.203 mm